# EAGLE schematic TeenScience-RevB3 (EAGLE 9.5.0), part 1 of 2

## Sheet 1 of 5
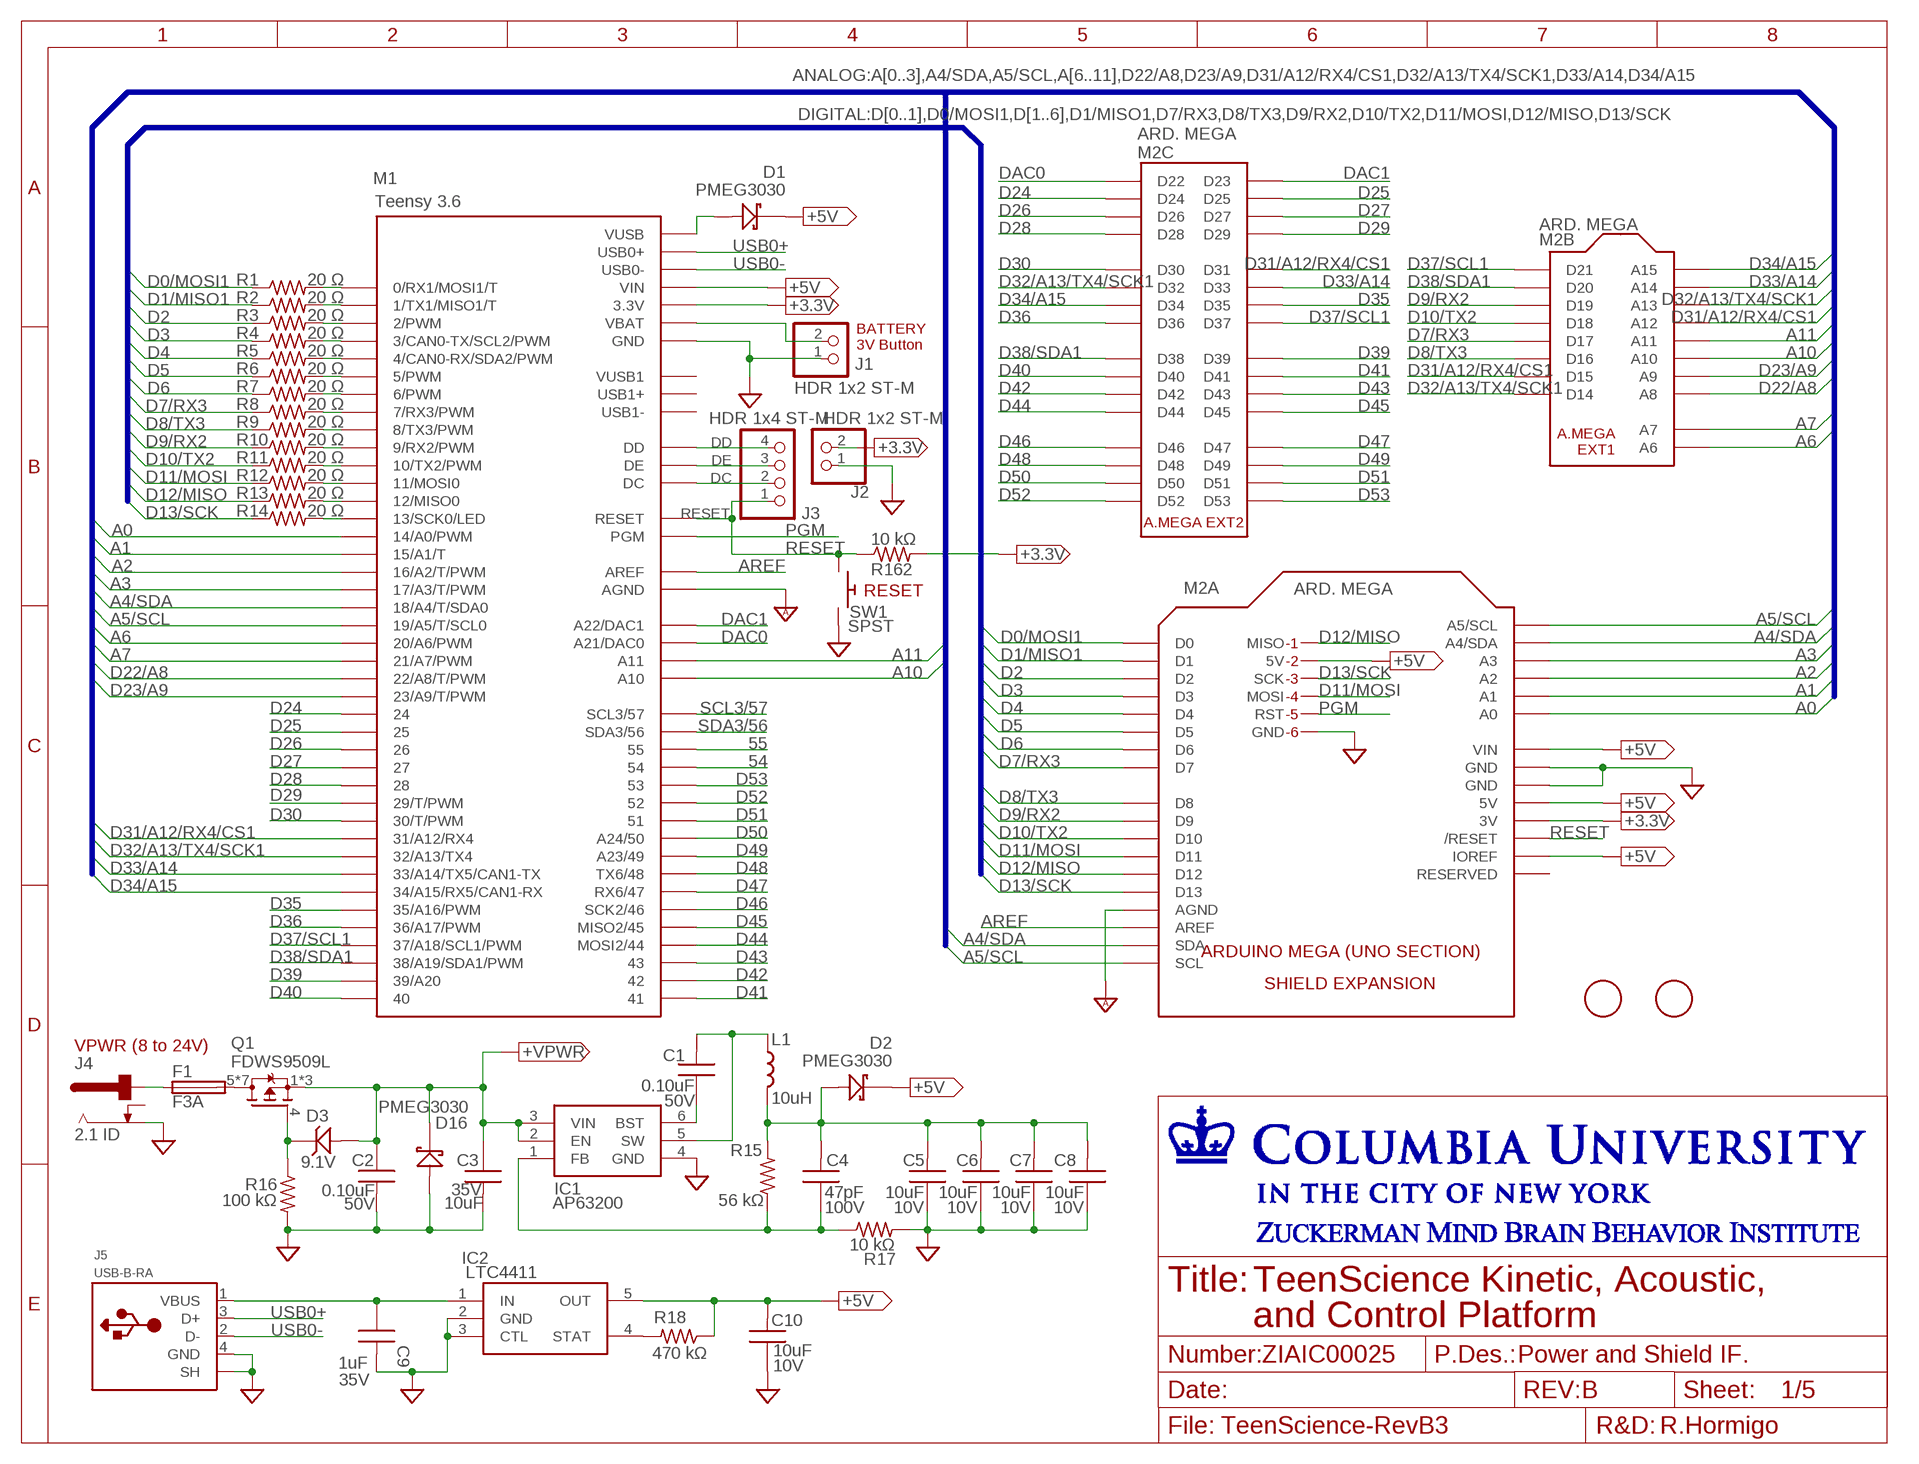
[diagram p0: schematic, sheet 1]
FRAME1 (LETTER_L): ENG_NAME: R.Hormigo; NUMBER: ZIAIC00025; PDESC: Power and Shield IF.; REV: B; TITLE_L1: TeenScience Kinetic, Acoustic,; TITLE_L2: and Control Platform

### Parts
C1  0.10uF  MLCC_0603_100N  [MLCC_0603]
C2  0.10uF  MLCC_0603_100N  [MLCC_0603]
C3  10uF  MLCC1206_  [MLCC_1206]
C4  47pF  MLCC_0603_47P  [MLCC_0603]
C5  10uF  MLCC_0603_10UF-10V  [MLCC_0603]
C6  10uF  MLCC_0603_10UF-10V  [MLCC_0603]
C7  10uF  MLCC_0603_10UF-10V  [MLCC_0603]
C8  10uF  MLCC_0603_10UF-10V  [MLCC_0603]
C9  1uF  MLCC_0603_1UF  [MLCC_0603]
C10  10uF  MLCC_0603_10UF-10V  [MLCC_0603]
D1  PMEG3030  DIODE_SCHOTTKY  [SOD_128_DIODE]
D2  PMEG3030  DIODE_SCHOTTKY  [SOD_128_DIODE]
D3  9.1V  DIODE_ZENERZND9.2V  [SOD3716X135N_DIODE]
D16  PMEG3030  DIODE_SCHOTTKY  [SOD_128_DIODE]
F1  F3A  FUSE  [1206-3.2X1.6MM]
IC1  AP63200  [SOT95P280X100-6N]
IC2  LTC4411  LTC4411ES5  [SOT95P280X100-5N]
J1  HDR 1x2 ST-M  PIN-1X22STMSHDR  [HDR_1X2]
J2  HDR 1x2 ST-M  PIN-1X22STMSHDR  [HDR_1X2]
J3  HDR 1x4 ST-M  PIN-1X44STMSHDR  [HDR_1X04]
J4  2.1 ID  DCJACK  [DCJACK-721RA]
J5  USB-B-RA  USB4+SHUSBBRA  [USB-B]
L1  10uH  INDUCTOR  [IND_5X5MM-5045]
M1  Teensy 3.6  TEENSY_3.X3_6ALL  [TEENSY_3.6_ALL_PINS&PADS]
M2  ARD. MEGA  ARDUINO_MEGA_ICSP  [ARDUINO_MEGA_ICSP]
Q1  FDWS9509L  MOSFET-PMFETPP-MOSFET  [FDN8_5.1X6.3]
R1  20 Ω  RES_0603_20R0  [R0603]
R2  20 Ω  RES_0603_20R0  [R0603]
R3  20 Ω  RES_0603_20R0  [R0603]
R4  20 Ω  RES_0603_20R0  [R0603]
R5  20 Ω  RES_0603_20R0  [R0603]
R6  20 Ω  RES_0603_20R0  [R0603]
R7  20 Ω  RES_0603_20R0  [R0603]
R8  20 Ω  RES_0603_20R0  [R0603]
R9  20 Ω  RES_0603_20R0  [R0603]
R10  20 Ω  RES_0603_20R0  [R0603]
R11  20 Ω  RES_0603_20R0  [R0603]
R12  20 Ω  RES_0603_20R0  [R0603]
R13  20 Ω  RES_0603_20R0  [R0603]
R14  20 Ω  RES_0603_20R0  [R0603]
R15  56 kΩ  RES_0603_56K0  [R0603]
R16  100 kΩ  RES_0603_100K  [R0603]
R17  10 kΩ  RES_0603_10K0  [R0603]
R18  470 kΩ  RES_0603_470K  [R0603]
R162  10 kΩ  RES_0603_10K0  [R0603]
SW1  SPST  SWITCH_SPSTSWDTS65  [SWITCH_TAC_6MM]
U$3  FIDUCIAL  [FIDUCIAL_1MM]
U$6  FIDUCIAL  [FIDUCIAL_1MM]

### Nets
54: M1.54 ; also sheet 4
55: M1.55 ; also sheet 4
+3.3V: J2.2 M1.3.3V M1.3.3V2(3.3V) M1.3.3V3(3.3V) M1.3.3V4(3.3V) M2.3V(A:3V) R162.2 ; also sheet 2,3,4,5
+5V: C10.2 D1.1(K) D2.1(K) IC2.5(OUT) M1.VIN M2.5V(A:5V) M2.5V@1(A:5V) M2.5V@2(A:5V) M2.5V_ICSP(A:5V) M2.IOREF(A:IOREF) M2.VIN(A:VIN) R18.1 ; also sheet 2,4,5
+VPWR: C2.1 C3.1 D3.2(A) D16.1(K) IC1.2(EN) IC1.3(VIN) Q1.1(S) Q1.2(S) Q1.3(S) ; also sheet 2,3,4
A0: M1.14/A0(14/A0/PWM) M2.A0(A:A0) ; also sheet 3
A1: M1.15/A1(15/A1/T) M2.A1(A:A1) ; also sheet 3
A2: M1.16/A2(16/A2/T/PWM) M2.A2(A:A2) ; also sheet 3
A3: M1.17/A3(17/A3/T/PWM) M2.A3(A:A3) ; also sheet 3
A4/SDA: M1.18/A4(18/A4/T/SDA0) M2.A4(A:A4/SDA) M2.SDA(A:SDA) ; also sheet 4,5
A5/SCL: M1.19/A5(19/A5/T/SCL0) M2.A5(A:A5/SCL) M2.SCL(A:SCL) ; also sheet 4,5
A6: M1.20/A6(20/A6/PWM) M2.A6(B:A6) ; also sheet 3
A7: M1.21/A7(21/A7/PWM) M2.A7(B:A7) ; also sheet 3
A10: M1.A10 M2.A10(B:A10)
A11: M1.A11 M2.A11(B:A11)
AREF: M1.AREF M2.AREF(A:AREF) ; also sheet 3
D0/MOSI1: M2.D0(A:D0) R1.1 ; also sheet 4
D1/MISO1: M2.D1(A:D1) R2.1 ; also sheet 4
D2: M2.D2(A:D2) R3.1 ; also sheet 2
D3: M2.D3(A:D3) R4.1 ; also sheet 2
D4: M2.D4(A:D4) R5.1 ; also sheet 2
D5: M2.D5(A:D5) R6.1 ; also sheet 2
D6: M2.D6(A:D6) R7.1 ; also sheet 2
D7/RX3: M2.D7(A:D7) M2.D17(B:D17) R8.1 ; also sheet 2
D8/TX3: M2.D8(A:D8) M2.D16(B:D16) R9.1 ; also sheet 2
D9/RX2: M2.D9(A:D9) M2.D19(B:D19) R10.1 ; also sheet 5
D10/TX2: M2.D10(A:D10) M2.D18(B:D18) R11.1 ; also sheet 4
D11/MOSI: M2.D11(A:D11) M2.MOSI(A:MOSI) R12.1 ; also sheet 5
D12/MISO: M2.D12(A:D12) M2.MISO(A:MISO) R13.1 ; also sheet 4
D13/SCK: M2.D13(A:D13) M2.SCK(A:SCK) R14.1 ; also sheet 5
D22/A8: M1.22/A8(22/A8/T/PWM) M2.A8(B:A8) ; also sheet 5
D23/A9: M1.23/A9(23/A9/T/PWM) M2.A9(B:A9) ; also sheet 5
D24: M1.24 M2.D24(C:D24) ; also sheet 2
D25: M1.25 M2.D25(C:D25) ; also sheet 2
D26: M1.26 M2.D26(C:D26) ; also sheet 2
D27: M1.27 M2.D27(C:D27) ; also sheet 2
D28: M1.28 M2.D28(C:D28) ; also sheet 2
D29: M1.29(29/T/PWM) M2.D29(C:D29) ; also sheet 2
D30: M1.30(30/T/PWM) M2.D30(C:D30) ; also sheet 2
D31/A12/RX4/CS1: M1.31/A12(31/A12/RX4) M2.A12(B:A12) M2.D15(B:D15) M2.D31(C:D31) ; also sheet 4
D32/A13/TX4/SCK1: M1.32/A13(32/A13/TX4) M2.A13(B:A13) M2.D14(B:D14) M2.D32(C:D32) ; also sheet 4
D33/A14: M1.33/A14(33/A14/TX5/CAN1-TX) M2.A14(B:A14) M2.D33(C:D33) ; also sheet 2
D34/A15: M1.34/A15(34/A15/RX5/CAN1-RX) M2.A15(B:A15) M2.D34(C:D34) ; also sheet 2
D35: M1.35/A16(35/A16/PWM) M2.D35(C:D35) ; also sheet 4
D36: M1.36/A17(36/A17/PWM) M2.D36(C:D36) ; also sheet 4
D37/SCL1: M1.37/A18(37/A18/SCL1/PWM) M2.D21(B:D21) M2.D37(C:D37) ; also sheet 4
D38/SDA1: M1.38/A19(38/A19/SDA1/PWM) M2.D20(B:D20) M2.D38(C:D38) ; also sheet 4
D39: M1.39/A20 M2.D39(C:D39) ; also sheet 4
D40: M1.40 M2.D40(C:D40) ; also sheet 4
D41: M1.41 M2.D41(C:D41) ; also sheet 4
D42: M1.42 M2.D42(C:D42) ; also sheet 4
D43: M1.43 M2.D43(C:D43) ; also sheet 2
D44: M1.44(MOSI2/44) M2.D44(C:D44) ; also sheet 2
D45: M1.45(MISO2/45) M2.D45(C:D45) ; also sheet 2
D46: M1.46(SCK2/46) M2.D46(C:D46) ; also sheet 2
D47: M1.47(RX6/47) M2.D47(C:D47) ; also sheet 4
D48: M1.48(TX6/48) M2.D48(C:D48) ; also sheet 2
D49: M1.49(A23/49) M2.D49(C:D49) ; also sheet 2
D50: M1.50(A24/50) M2.D50(C:D50) ; also sheet 2
D51: M1.51 M2.D51(C:D51) ; also sheet 2
D52: M1.52 M2.D52(C:D52) ; also sheet 2
D53: M1.53 M2.D53(C:D53) ; also sheet 2
DAC0: M1.A21(A21/DAC0) M2.D22(C:D22) ; also sheet 3
DAC1: M1.A22(A22/DAC1) M2.D23(C:D23) ; also sheet 3
DC: J3.2 M1.DC
DD: J3.4 M1.DD
DE: J3.3 M1.DE
GND: C2.2 C3.2 C5.1 C6.1 C7.1 C8.1 C9.2 C10.1 D16.2(A) IC1.4(GND) IC2.2(GND) IC2.3(CTL) J1.1 J2.1 J4.2(SLEEVE) J5.4(GND) J5.5(SH) J5.6(SH) M1.GND M1.GND1(GND) M1.GND2(GND) M1.GND3(GND) M1.GND4(GND) M1.GND5(GND) M1.GND6(GND) M2.GND@1(A:GND) M2.GND@2(A:GND) M2.GND@3(A:GND) M2.GND@4(A:GND) M2.GND@5(A:GND) R16.2 R17.2 SW1.3 SW1.4 ; also sheet 2,4,5
GND_A: M1.AGND M2.AGND(A:AGND) ; also sheet 3,5
N$1: D1.2(A) M1.VUSB
N$2: C9.1 IC2.1(IN) J5.1(VBUS)
N$3: IC2.4(STAT) R18.2
N$4: J1.2 M1.VBAT
N$5: F1.1 J4.1(CENTER)
N$6: C4.2 C5.2 C6.2 C7.2 C8.2 D2.2(A) L1.2 R15.2
N$7: F1.2 Q1.5(D) Q1.6(D) Q1.7(D) Q1.8(D) Q1.9(D) Q1.10(D) Q1.11(D)
N$8: D3.1(K) Q1.4(G) R16.1
N$10: C1.2 IC1.5(SW) L1.1
N$11: C4.1 IC1.1(FB) R15.1 R17.1
N$12: C1.1 IC1.6(BST)
N$13: M1.13(13/SCK0/LED) R14.2
N$18: M1.0(0/RX1/MOSI1/T) R1.2
N$21: M1.1(1/TX1/MISO1/T) R2.2
N$24: M1.2(2/PWM) R3.2
N$25: M1.3(3/CAN0-TX/SCL2/PWM) R4.2
N$26: M1.4(4/CAN0-RX/SDA2/PWM) R5.2
N$27: M1.5(5/PWM) R6.2
N$28: M1.6(6/PWM) R7.2
N$29: M1.7(7/RX3/PWM) R8.2
N$30: M1.8(8/TX3/PWM) R9.2
N$31: M1.9(9/RX2/PWM) R10.2
N$32: M1.10(10/TX2/PWM) R11.2
N$33: M1.11(11/MOSI0) R12.2
N$34: M1.12(12/MISO0) R13.2
PGM: M1.PGM M2.RESET_ICSP(A:RST)
RESET: J3.1 M1.RESET M2.RESET(A:/RESET) R162.1 SW1.1 SW1.2 ; also sheet 4,5
SCL3/57: M1.57(SCL3/57) ; also sheet 4
SDA3/56: M1.56(SDA3/56) ; also sheet 4
USB0+: J5.3(D+) M1.USB0+
USB0-: J5.2(D-) M1.USB0-
Unconnected: J4.3(SHUNT) M1.USB1+ M1.USB1- M2.RESERVED(A:RESERVED)

### Buses
DIGITAL:D[0..1],D0/MOSI1,D[1..6],D1/MISO1,D7/RX3,D8/TX3,D9/RX2,D10/TX2,D11/MOSI,D12/MISO,D13/SCK
ANALOG:A[0..3],A4/SDA,A5/SCL,A[6..11],D22/A8,D23/A9,D31/A12/RX4/CS1,D32/A13/TX4/SCK1,D33/A14,D34/A15

### Notes on the sheet
- BATTERY
  3V Button
- RESET
- VPWR (8 to 24V)

## Sheet 2 of 5
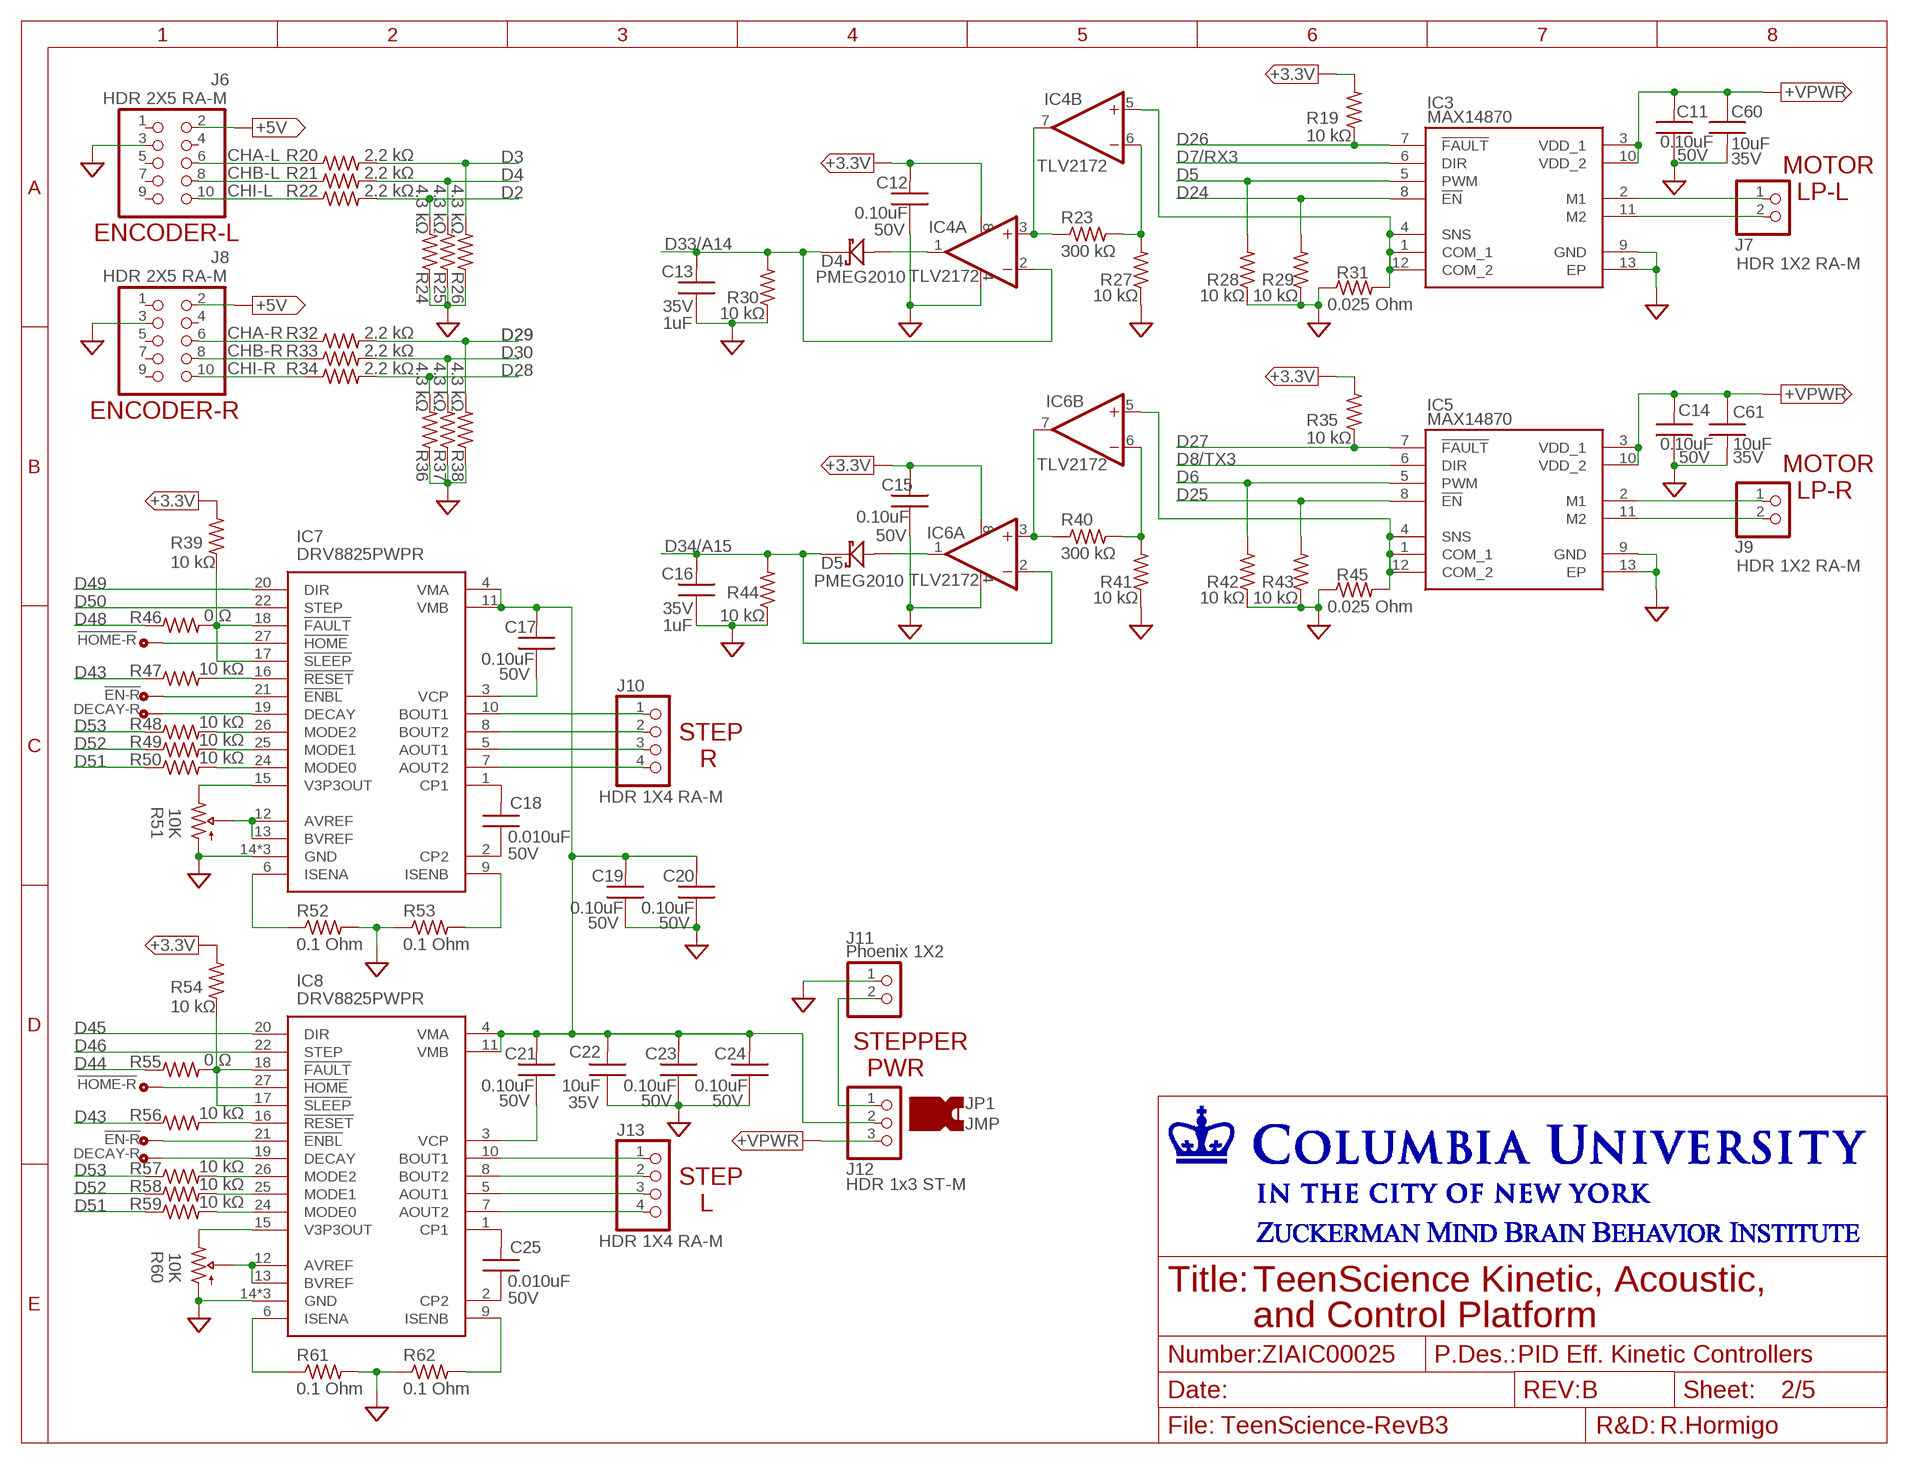
[diagram p1: schematic, sheet 2]
FRAME2 (LETTER_L): ENG_NAME: R.Hormigo; NUMBER: ZIAIC00025; PDESC: PID Eff. Kinetic Controllers; REV: B; TITLE_L1: TeenScience Kinetic, Acoustic,; TITLE_L2: and Control Platform
JP1 (JUMPERJUMPER): CURRENT: 1A; DESCRIPTION: Header Jumper 0.1"; DIMENSIONS: 0.1" Pitch 5X6mm; DSHEET: https://www.mouser.com/datasheet/2/181/M7580-M7583-1134644.pdf; MNF: Harwin; MPN: M7582-05; VALUE: JMP; VENDOR: Mouser

### Parts
C11  0.10uF  MLCC_0603_100N  [MLCC_0603]
C12  0.10uF  MLCC_0603_100N  [MLCC_0603]
C13  1uF  MLCC_0603_1UF  [MLCC_0603]
C14  0.10uF  MLCC_0603_100N  [MLCC_0603]
C15  0.10uF  MLCC_0603_100N  [MLCC_0603]
C16  1uF  MLCC_0603_1UF  [MLCC_0603]
C17  0.10uF  MLCC_0603_100N  [MLCC_0603]
C18  0.010uF  MLCC_0603_10N  [MLCC_0603]
C19  0.10uF  MLCC_0603_100N  [MLCC_0603]
C20  0.10uF  MLCC_0603_100N  [MLCC_0603]
C21  0.10uF  MLCC_0603_100N  [MLCC_0603]
C22  10uF  MLCC1206_  [MLCC_1206]
C23  0.10uF  MLCC_0603_100N  [MLCC_0603]
C24  0.10uF  MLCC_0603_100N  [MLCC_0603]
C25  0.010uF  MLCC_0603_10N  [MLCC_0603]
C60  10uF  MLCC1206_  [MLCC_1206]
C61  10uF  MLCC1206_  [MLCC_1206]
D4  PMEG2010  DIODE_SCHOTTKYSIGNAL_SCHOTTKY  [SOD-123FL]
D5  PMEG2010  DIODE_SCHOTTKYSIGNAL_SCHOTTKY  [SOD-123FL]
IC3  MAX14870  MAX14870ETC+TMAX14870FS  [TDFN12-EP]
IC4  TLV2172  OPA_D_TLV2172IDGKR  [VSSOP8-DGK-065P]
IC5  MAX14870  MAX14870ETC+TMAX14870FS  [TDFN12-EP]
IC6  TLV2172  OPA_D_TLV2172IDGKR  [VSSOP8-DGK-065P]
IC7  DRV8825PWPR  [TSSOP28-PWR]
IC8  DRV8825PWPR  [TSSOP28-PWR]
J6  HDR 2X5 RA-M  PIN-2X5HDR_2X5RAS_M  [HDR_2X5M_RAS]
J7  HDR 1X2 RA-M  PIN-1X2HDR_1X2RAS_M  [HDR_1X2RAS]
J8  HDR 2X5 RA-M  PIN-2X5HDR_2X5RAS_M  [HDR_2X5M_RAS]
J9  HDR 1X2 RA-M  PIN-1X2HDR_1X2RAS_M  [HDR_1X2RAS]
J10  HDR 1X4 RA-M  PIN-1X4HDR_1X4RAS_M  [HDR_1X4RAS]
J11  Phoenix 1X2  PIN-1X2PHO2PHOENIX1X2  [TE_282834-2_PHOENIX2]
J12  HDR 1x3 ST-M  PIN-1X33STMSHDR  [HDR_1X3]
J13  HDR 1X4 RA-M  PIN-1X4HDR_1X4RAS_M  [HDR_1X4RAS]
R19  10 kΩ  RES_0603_10K0  [R0603]
R20  2.2 kΩ  RES_0603_2K20  [R0603]
R21  2.2 kΩ  RES_0603_2K20  [R0603]
R22  2.2 kΩ  RES_0603_2K20  [R0603]
R23  300 kΩ  RES_0603_300K  [R0603]
R24  4.3 kΩ  RES_0603_4K30  [R0603]
R25  4.3 kΩ  RES_0603_4K30  [R0603]
R26  4.3 kΩ  RES_0603_4K30  [R0603]
R27  10 kΩ  RES_0603_10K0  [R0603]
R28  10 kΩ  RES_0603_10K0  [R0603]
R29  10 kΩ  RES_0603_10K0  [R0603]
R30  10 kΩ  RES_0603_10K0  [R0603]
R31  0.025 Ohm  RES_1206_0.025  [R1206]
R32  2.2 kΩ  RES_0603_2K20  [R0603]
R33  2.2 kΩ  RES_0603_2K20  [R0603]
R34  2.2 kΩ  RES_0603_2K20  [R0603]
R35  10 kΩ  RES_0603_10K0  [R0603]
R36  4.3 kΩ  RES_0603_4K30  [R0603]
R37  4.3 kΩ  RES_0603_4K30  [R0603]
R38  4.3 kΩ  RES_0603_4K30  [R0603]
R39  10 kΩ  RES_0603_10K0  [R0603]
R40  300 kΩ  RES_0603_300K  [R0603]
R41  10 kΩ  RES_0603_10K0  [R0603]
R42  10 kΩ  RES_0603_10K0  [R0603]
R43  10 kΩ  RES_0603_10K0  [R0603]
R44  10 kΩ  RES_0603_10K0  [R0603]
R45  0.025 Ohm  RES_1206_0.025  [R1206]
R46  0 Ω  RES_0603_0000  [R0603]
R47  10 kΩ  RES_0603_10K0  [R0603]
R48  10 kΩ  RES_0603_10K0  [R0603]
R49  10 kΩ  RES_0603_10K0  [R0603]
R50  10 kΩ  RES_0603_10K0  [R0603]
R51  10K  RES_TRIM_SMT_TRIM_4.5MM_10K  [SM-4.5X4.5-TRIM]
R52  0.1 Ohm  RES_1210_  [R1210]
R53  0.1 Ohm  RES_1210_  [R1210]
R54  10 kΩ  RES_0603_10K0  [R0603]
R55  0 Ω  RES_0603_0000  [R0603]
R56  10 kΩ  RES_0603_10K0  [R0603]
R57  10 kΩ  RES_0603_10K0  [R0603]
R58  10 kΩ  RES_0603_10K0  [R0603]
R59  10 kΩ  RES_0603_10K0  [R0603]
R60  10K  RES_TRIM_SMT_TRIM_4.5MM_10K  [SM-4.5X4.5-TRIM]
R61  0.1 Ohm  RES_1210_  [R1210]
R62  0.1 Ohm  RES_1210_  [R1210]
TP1  !HOME-R  SMT_TP  [SMT_TEST]
TP2  !EN-R  SMT_TP  [SMT_TEST]
TP3  DECAY-R  SMT_TP  [SMT_TEST]
TP4  !HOME-R  SMT_TP  [SMT_TEST]
TP5  !EN-R  SMT_TP  [SMT_TEST]
TP6  DECAY-R  SMT_TP  [SMT_TEST]

### Nets
+3.3V: C12.2 C15.2 IC4.8(A:V+) IC6.8(A:V+) R19.2 R35.2 R39.2 R54.2 ; also sheet 1,3,4,5
+5V: J6.2 J8.2 ; also sheet 1,4,5
+VPWR: C11.2 C14.2 C60.1 C61.1 IC3.3(VDD_1) IC3.10(VDD_2) IC5.3(VDD_1) IC5.10(VDD_2) J12.3 ; also sheet 1,3,4
CHA-L: J6.6 R20.1
CHA-R: J8.6 R32.1
CHB-L: J6.8 R21.1
CHB-R: J8.8 R33.1
CHI-L: J6.10 R22.1
CHI-R: J8.10 R34.1
D2: R22.2 R24.2 ; also sheet 1
D3: R20.2 R26.2 ; also sheet 1
D4: R21.2 R25.2 ; also sheet 1
D5: IC3.5(PWM) R28.2 ; also sheet 1
D6: IC5.5(PWM) R42.2 ; also sheet 1
D7/RX3: IC3.6(DIR) ; also sheet 1
D8/TX3: IC5.6(DIR) ; also sheet 1
D24: IC3.8(!EN) R29.2 ; also sheet 1
D25: IC5.8(!EN) R43.2 ; also sheet 1
D26: IC3.7(!FAULT) R19.1 ; also sheet 1
D27: IC5.7(!FAULT) R35.1 ; also sheet 1
D28: R34.2 R36.2 ; also sheet 1
D29: R32.2 R38.2 ; also sheet 1
D30: R33.2 R37.2 ; also sheet 1
D33/A14: C13.2 D4.1(K) IC4.2(A:-IN) R30.2 ; also sheet 1
D34/A15: C16.2 D5.1(K) IC6.2(A:-IN) R44.2 ; also sheet 1
D43: R47.1 R56.1 ; also sheet 1
D44: R55.1 ; also sheet 1
D45: IC8.20(DIR) ; also sheet 1
D46: IC8.22(STEP) ; also sheet 1
D48: R46.1 ; also sheet 1
D49: IC7.20(DIR) ; also sheet 1
D50: IC7.22(STEP) ; also sheet 1
D51: R50.1 R59.1 ; also sheet 1
D52: R49.1 R58.1 ; also sheet 1
D53: R48.1 R57.1 ; also sheet 1
GND: C11.1 C12.1 C13.1 C14.1 C15.1 C16.1 C19.1 C20.1 C22.1 C23.1 C24.1 C60.2 C61.2 IC3.9(GND) IC3.13(EP) IC4.4(A:V-) IC5.9(GND) IC5.13(EP) IC6.4(A:V-) IC7.14(GND) IC7.28(GND) IC7.29(GND) IC8.14(GND) IC8.28(GND) IC8.29(GND) J6.3 J8.3 J11.1 R24.1 R25.1 R26.1 R27.1 R28.1 R29.1 R30.1 R31.1 R36.1 R37.1 R38.1 R41.1 R42.1 R43.1 R44.1 R45.1 R51.3(START) R52.2 R53.1 R60.3(START) R61.2 R62.1 ; also sheet 1,4,5
N$35: IC5.2(M1) J9.1
N$36: IC5.11(M2) J9.2
N$37: D5.2(A) IC6.1(A:OUT)
N$38: IC6.6(B:-IN) R40.2 R41.2
N$39: IC5.1(COM_1) IC5.4(SNS) IC5.12(COM_2) IC6.5(B:+IN) R45.2
N$40: IC3.2(M1) J7.1
N$41: IC6.3(A:+IN) IC6.7(B:OUT) R40.1
N$42: IC3.11(M2) J7.2
N$43: IC3.1(COM_1) IC3.4(SNS) IC3.12(COM_2) IC4.5(B:+IN) R31.2
N$44: D4.2(A) IC4.1(A:OUT)
N$45: IC4.6(B:-IN) R23.2 R27.2
N$46: IC4.3(A:+IN) IC4.7(B:OUT) R23.1
N$49: J11.2 J12.1
N$50: IC8.15(V3P3OUT) R60.1(END)
N$51: IC8.12(AVREF) IC8.13(BVREF) R60.2(WIPER)
N$52: IC8.6(ISENA) R61.1
N$53: C21.1 IC8.3(VCP)
N$54: IC8.9(ISENB) R62.2
N$55: C25.1 IC8.2(CP2)
N$56: C25.2 IC8.1(CP1)
N$57: IC8.10(BOUT1) J13.1
N$58: IC8.8(BOUT2) J13.2
N$59: IC8.5(AOUT1) J13.3
N$60: IC8.7(AOUT2) J13.4
N$61: IC8.27(!HOME) TP1.NC1 TP1.NC2 TP1.NC3 TP1.TP
N$62: IC8.24(MODE0) R59.2
N$63: IC8.25(MODE1) R58.2
N$64: IC8.26(MODE2) R57.2
N$65: C17.2 C19.2 C20.2 C21.2 C22.2 C23.2 C24.2 IC7.4(VMA) IC7.11(VMB) IC8.4(VMA) IC8.11(VMB) J12.2
N$66: IC7.12(AVREF) IC7.13(BVREF) R51.2(WIPER)
N$67: IC7.6(ISENA) R52.1
N$68: IC8.17(!SLEEP) IC8.18(!FAULT) R54.1 R55.2
N$69: IC7.9(ISENB) R53.2
N$70: C18.1 IC7.2(CP2)
N$71: C18.2 IC7.1(CP1)
N$72: IC7.15(V3P3OUT) R51.1(END)
N$73: IC8.19(DECAY) TP3.NC1 TP3.NC2 TP3.NC3 TP3.TP
N$74: IC8.21(!ENBL) TP2.NC1 TP2.NC2 TP2.NC3 TP2.TP
N$75: IC8.16(!RESET) R56.2
N$76: C17.1 IC7.3(VCP)
N$77: IC7.10(BOUT1) J10.1
N$78: IC7.8(BOUT2) J10.2
N$79: IC7.5(AOUT1) J10.3
N$80: IC7.7(AOUT2) J10.4
N$81: IC7.27(!HOME) TP4.NC1 TP4.NC2 TP4.NC3 TP4.TP
N$82: IC7.24(MODE0) R50.2
N$83: IC7.25(MODE1) R49.2
N$84: IC7.26(MODE2) R48.2
N$85: IC7.17(!SLEEP) IC7.18(!FAULT) R39.1 R46.2
N$86: IC7.19(DECAY) TP6.NC1 TP6.NC2 TP6.NC3 TP6.TP
N$87: IC7.21(!ENBL) TP5.NC1 TP5.NC2 TP5.NC3 TP5.TP
N$88: IC7.16(!RESET) R47.2
Unconnected: J6.1 J6.4 J6.5 J6.7 J6.9 J8.1 J8.4 J8.5 J8.7 J8.9

### Notes on the sheet
- MOTOR
    LP-L
- ENCODER-L
- ENCODER-R
- MOTOR
    LP-R
- STEP
     R
- STEPPER
    PWR
- STEP
     L

## Sheet 3 of 5
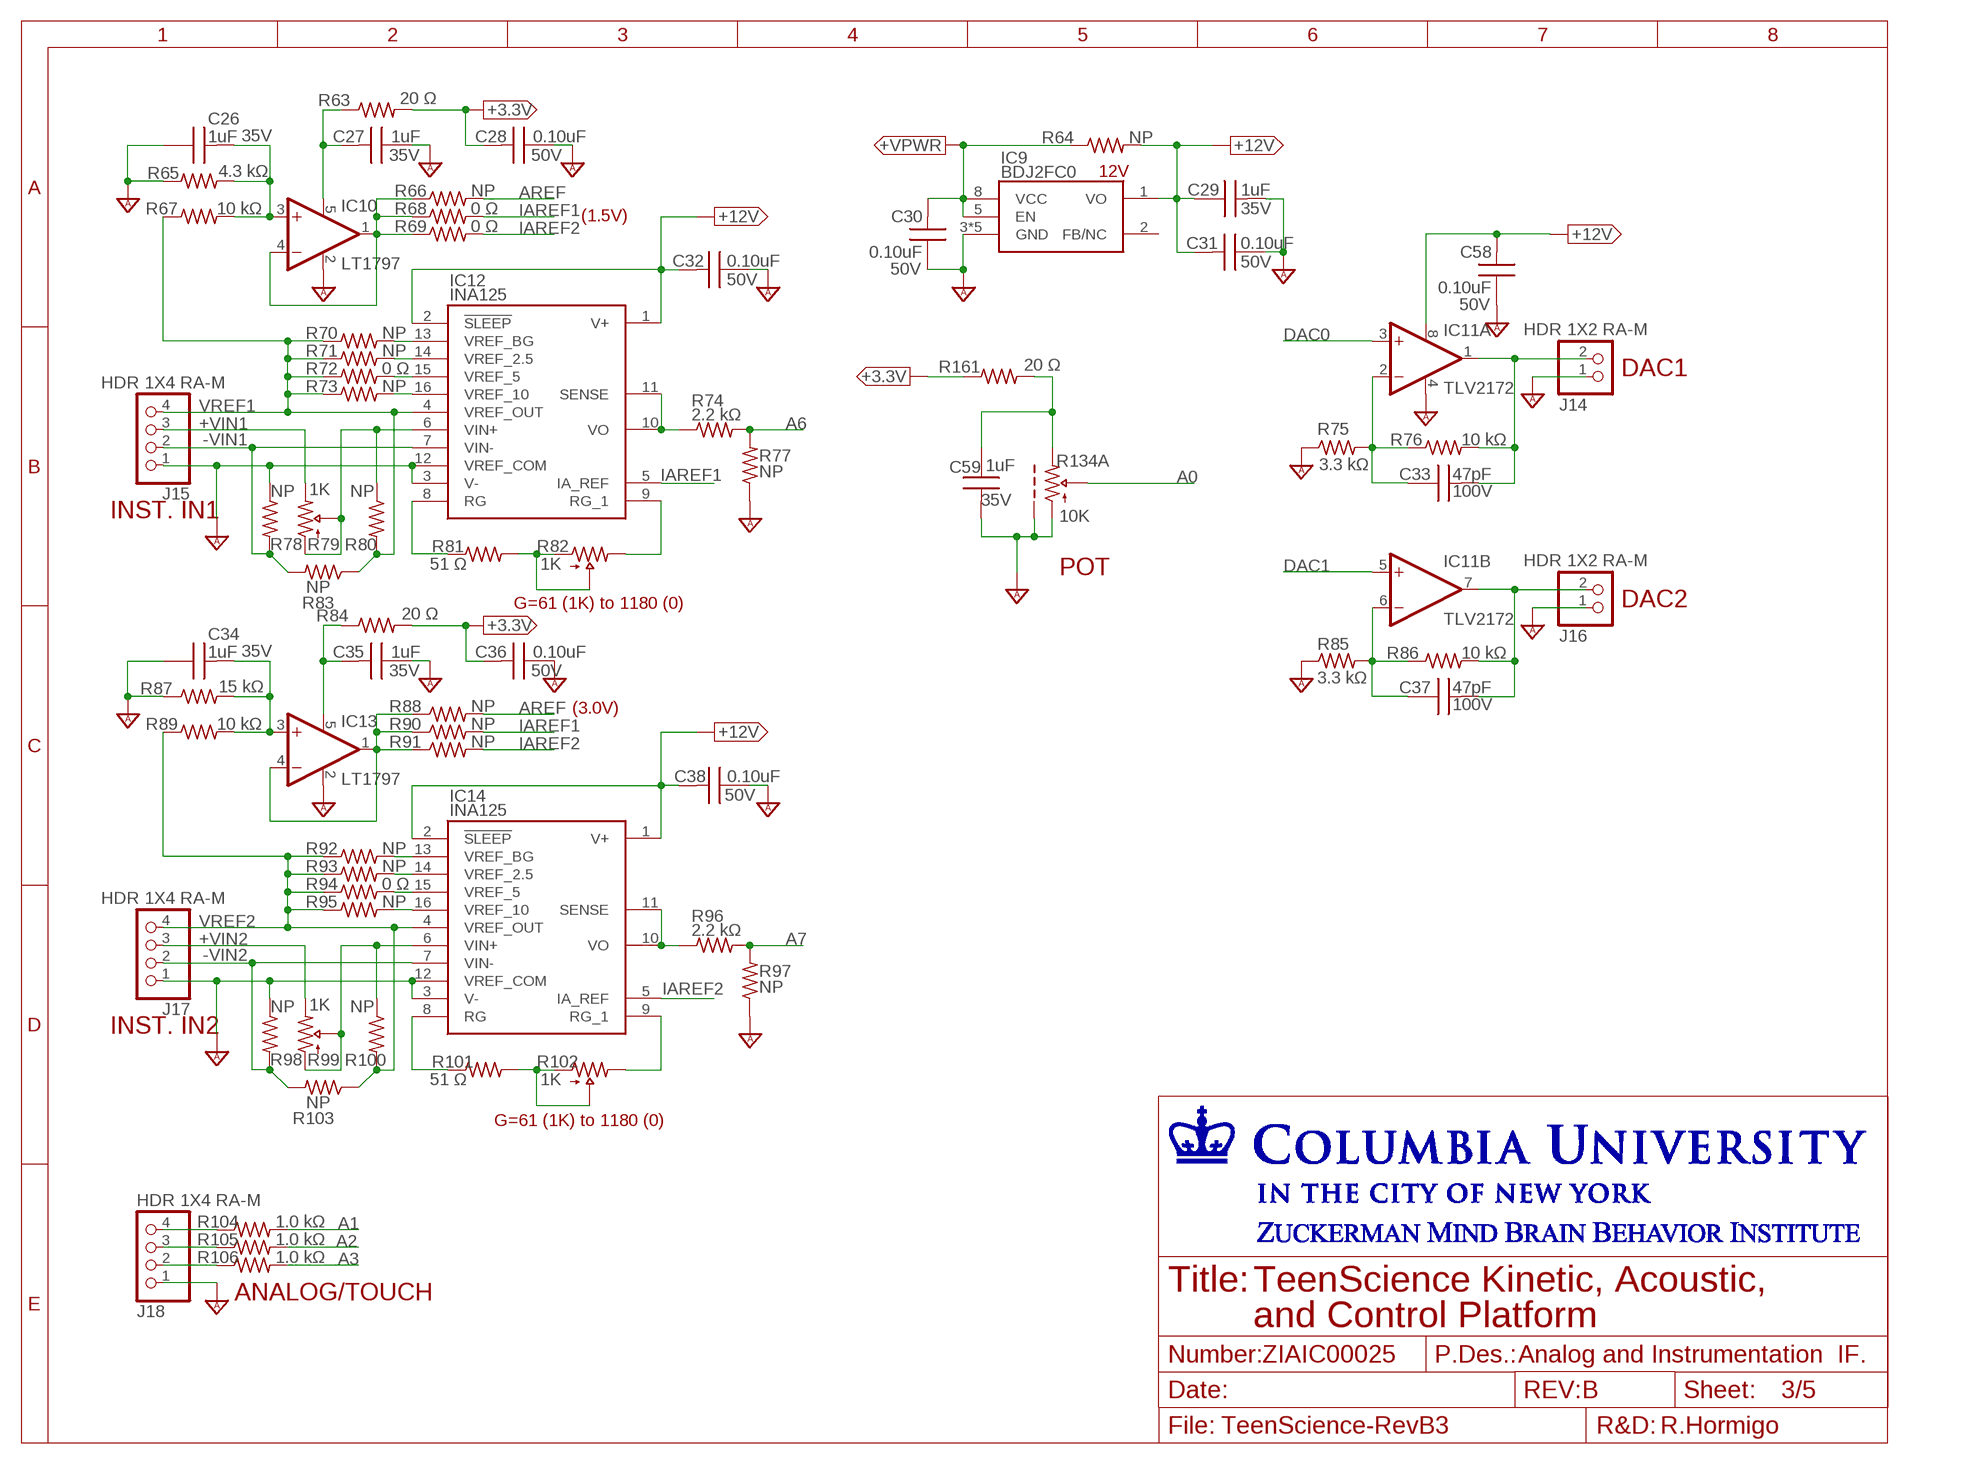
[diagram p2: schematic, sheet 3]
FRAME3 (LETTER_L): ENG_NAME: R.Hormigo; NUMBER: ZIAIC00025; PDESC: Analog and Instrumentation IF.; REV: B; TITLE_L1: TeenScience Kinetic, Acoustic,; TITLE_L2: and Control Platform

### Parts
C26  1uF  MLCC_0603_1UF  [MLCC_0603]
C27  1uF  MLCC_0603_1UF  [MLCC_0603]
C28  0.10uF  MLCC_0603_100N  [MLCC_0603]
C29  1uF  MLCC_0603_1UF  [MLCC_0603]
C30  0.10uF  MLCC_0603_100N  [MLCC_0603]
C31  0.10uF  MLCC_0603_100N  [MLCC_0603]
C32  0.10uF  MLCC_0603_100N  [MLCC_0603]
C33  47pF  MLCC_0603_47P  [MLCC_0603]
C34  1uF  MLCC_0603_1UF  [MLCC_0603]
C35  1uF  MLCC_0603_1UF  [MLCC_0603]
C36  0.10uF  MLCC_0603_100N  [MLCC_0603]
C37  47pF  MLCC_0603_47P  [MLCC_0603]
C38  0.10uF  MLCC_0603_100N  [MLCC_0603]
C58  0.10uF  MLCC_0603_100N  [MLCC_0603]
C59  1uF  MLCC_0603_1UF  [MLCC_0603]
IC9  BDJ2FC0  BDXXFC0  [SOIC8-PAD127P600X100]
IC10  LT1797  OPA_S_LT1797  [SOT23-5]
IC11  TLV2172  OPA_D_TLV2172IDGKR  [VSSOP8-DGK-065P]
IC12  INA125  INA125U  [SOIC16-127P600X175]
IC13  LT1797  OPA_S_LT1797  [SOT23-5]
IC14  INA125  INA125U  [SOIC16-127P600X175]
J14  HDR 1X2 RA-M  PIN-1X2HDR_1X2RAS_M  [HDR_1X2RAS]
J15  HDR 1X4 RA-M  PIN-1X4HDR_1X4RAS_M  [HDR_1X4RAS]
J16  HDR 1X2 RA-M  PIN-1X2HDR_1X2RAS_M  [HDR_1X2RAS]
J17  HDR 1X4 RA-M  PIN-1X4HDR_1X4RAS_M  [HDR_1X4RAS]
J18  HDR 1X4 RA-M  PIN-1X4HDR_1X4RAS_M  [HDR_1X4RAS]
R63  20 Ω  RES_0603_20R0  [R0603]
R64  NP  RES_0603_NP  [R0603]
R65  4.3 kΩ  RES_0603_4K30  [R0603]
R66  NP  RES_0603_NP  [R0603]
R67  10 kΩ  RES_0603_10K0  [R0603]
R68  0 Ω  RES_0603_0000  [R0603]
R69  0 Ω  RES_0603_0000  [R0603]
R70  NP  RES_0603_NP  [R0603]
R71  NP  RES_0603_NP  [R0603]
R72  0 Ω  RES_0603_0000  [R0603]
R73  NP  RES_0603_NP  [R0603]
R74  2.2 kΩ  RES_0603_2K20  [R0603]
R75  3.3 kΩ  RES_0603_3K30  [R0603]
R76  10 kΩ  RES_0603_10K0  [R0603]
R77  NP  RES_0603_NP  [R0603]
R78  NP  RES_0603_NP  [R0603]
R79  1K  RES_TRIM_1K  [PV36YTRIMMER]
R80  NP  RES_0603_NP  [R0603]
R81  51 Ω  RES_0603_51R0  [R0603]
R82  1K  RES_TRIM_1K  [PV36YTRIMMER]
R83  NP  RES_0603_NP  [R0603]
R84  20 Ω  RES_0603_20R0  [R0603]
R85  3.3 kΩ  RES_0603_3K30  [R0603]
R86  10 kΩ  RES_0603_10K0  [R0603]
R87  15 kΩ  RES_0603_15K0  [R0603]
R88  NP  RES_0603_NP  [R0603]
R89  10 kΩ  RES_0603_10K0  [R0603]
R90  NP  RES_0603_NP  [R0603]
R91  NP  RES_0603_NP  [R0603]
R92  NP  RES_0603_NP  [R0603]
R93  NP  RES_0603_NP  [R0603]
R94  0 Ω  RES_0603_0000  [R0603]
R95  NP  RES_0603_NP  [R0603]
R96  2.2 kΩ  RES_0603_2K20  [R0603]
R97  NP  RES_0603_NP  [R0603]
R98  NP  RES_0603_NP  [R0603]
R99  1K  RES_TRIM_1K  [PV36YTRIMMER]
R100  NP  RES_0603_NP  [R0603]
R101  51 Ω  RES_0603_51R0  [R0603]
R102  1K  RES_TRIM_1K  [PV36YTRIMMER]
R103  NP  RES_0603_NP  [R0603]
R104  1.0 kΩ  RES_0603_1K00  [R0603]
R105  1.0 kΩ  RES_0603_1K00  [R0603]
R106  1.0 kΩ  RES_0603_1K00  [R0603]
R134  10K  POT  [RK09-ALPS-VERT-POT]
R161  20 Ω  RES_0603_20R0  [R0603]

### Nets
+3.3V: C28.2 C36.2 R63.2 R84.2 R161.1 ; also sheet 1,2,4,5
+12V: C29.1 C31.2 C32.2 C38.2 C58.2 IC9.1(VO) IC11.8(A:V+) IC12.1(V+) IC12.2(!SLEEP) IC14.1(V+) IC14.2(!SLEEP) R64.2
+VIINDIR1: IC12.6(VIN+) R79.1(START) R79.2(WIPER) R80.1
+VIINDIR2: IC14.6(VIN+) R99.1(START) R99.2(WIPER) R100.1
+VIN1: J15.3 R79.3(END)
+VIN2: J17.3 R99.3(END)
+VPWR: C30.2 IC9.5(EN) IC9.8(VCC) R64.1 ; also sheet 1,2,4
-VIN1: IC12.7(VIN-) J15.2 R78.2 R83.2
-VIN2: IC14.7(VIN-) J17.2 R98.2 R103.2
A0: R134.2(A:WIPER) ; also sheet 1
A1: R104.2 ; also sheet 1
A2: R105.2 ; also sheet 1
A3: R106.2 ; also sheet 1
A6: R74.2 R77.2 ; also sheet 1
A7: R96.2 R97.2 ; also sheet 1
AREF: R66.2 R88.2 ; also sheet 1
DAC0: IC11.3(A:+IN) ; also sheet 1
DAC1: IC11.5(B:+IN) ; also sheet 1
GND_A: C26.1 C27.1 C28.1 C29.2 C30.1 C31.1 C32.1 C34.1 C35.1 C36.1 C38.1 C58.1 C59.2 IC9.3(GND) IC9.4(GND) IC9.6(GND) IC9.7(GND) IC9.9(GND) IC10.2(V-) IC11.4(A:V-) IC12.3(V-) IC12.12(VREF_COM) IC13.2(V-) IC14.3(V-) IC14.12(VREF_COM) J14.1 J15.1 J16.1 J17.1 J18.1 R65.1 R75.1 R77.1 R78.1 R85.1 R87.1 R97.1 R98.1 R134.1(A:START) R134.MH1(B:SHELL) R134.MH2(B:SHELL) ; also sheet 1,5
IAREF1: IC12.5(IA_REF) R68.2 R90.2
IAREF2: IC14.5(IA_REF) R69.2 R91.2
N$20: C27.2 IC10.5(V+) R63.1
N$23: C59.1 R134.3(A:END) R161.2
N$48: J18.4 R104.1
N$89: J18.3 R105.1
N$90: J18.2 R106.1
N$103: IC12.10(VO) IC12.11(SENSE) R74.1
N$104: IC12.13(VREF_BG) R70.2
N$105: C26.2 IC10.3(+IN) R65.2 R67.2
N$106: IC10.1(OUT) IC10.4(-IN) R66.1 R68.1 R69.1
N$107: R81.2 R82.1(START) R82.2(WIPER)
N$108: IC12.14(VREF_2.5) R71.2
N$109: IC12.15(VREF_5) R72.2
N$110: IC12.16(VREF_10) R73.2
N$111: R101.2 R102.1(START) R102.2(WIPER)
N$112: IC12.8(RG) R81.1
N$113: IC12.9(RG_1) R82.3(END)
N$114: IC14.14(VREF_2.5) R93.2
N$115: IC14.15(VREF_5) R94.2
N$116: IC14.16(VREF_10) R95.2
N$117: IC14.8(RG) R101.1
N$118: IC14.9(RG_1) R102.3(END)
N$119: IC14.13(VREF_BG) R92.2
N$120: IC14.10(VO) IC14.11(SENSE) R96.1
N$121: C34.2 IC13.3(+IN) R87.2 R89.2
N$122: IC13.1(OUT) IC13.4(-IN) R88.1 R90.1 R91.1
N$123: C35.2 IC13.5(V+) R84.1
N$124: C33.1 IC11.2(A:-IN) R75.2 R76.1
N$125: C33.2 IC11.1(A:OUT) J14.2 R76.2
N$127: C37.1 IC11.6(B:-IN) R85.2 R86.1
N$128: C37.2 IC11.7(B:OUT) J16.2 R86.2
VREF1: IC12.4(VREF_OUT) J15.4 R67.1 R70.1 R71.1 R72.1 R73.1 R80.2 R83.1
VREF2: IC14.4(VREF_OUT) J17.4 R89.1 R92.1 R93.1 R94.1 R95.1 R100.2 R103.1
Unconnected: IC9.2(FB/NC)

### Notes on the sheet
- 12V
- (1.5V)
- DAC1
- INST. IN1
- POT
- G=61 (1K) to 1180 (0) | DAC2
- (3.0V)
- INST. IN2
- G=61 (1K) to 1180 (0)
- ANALOG/TOUCH

## Sheet 4 of 5
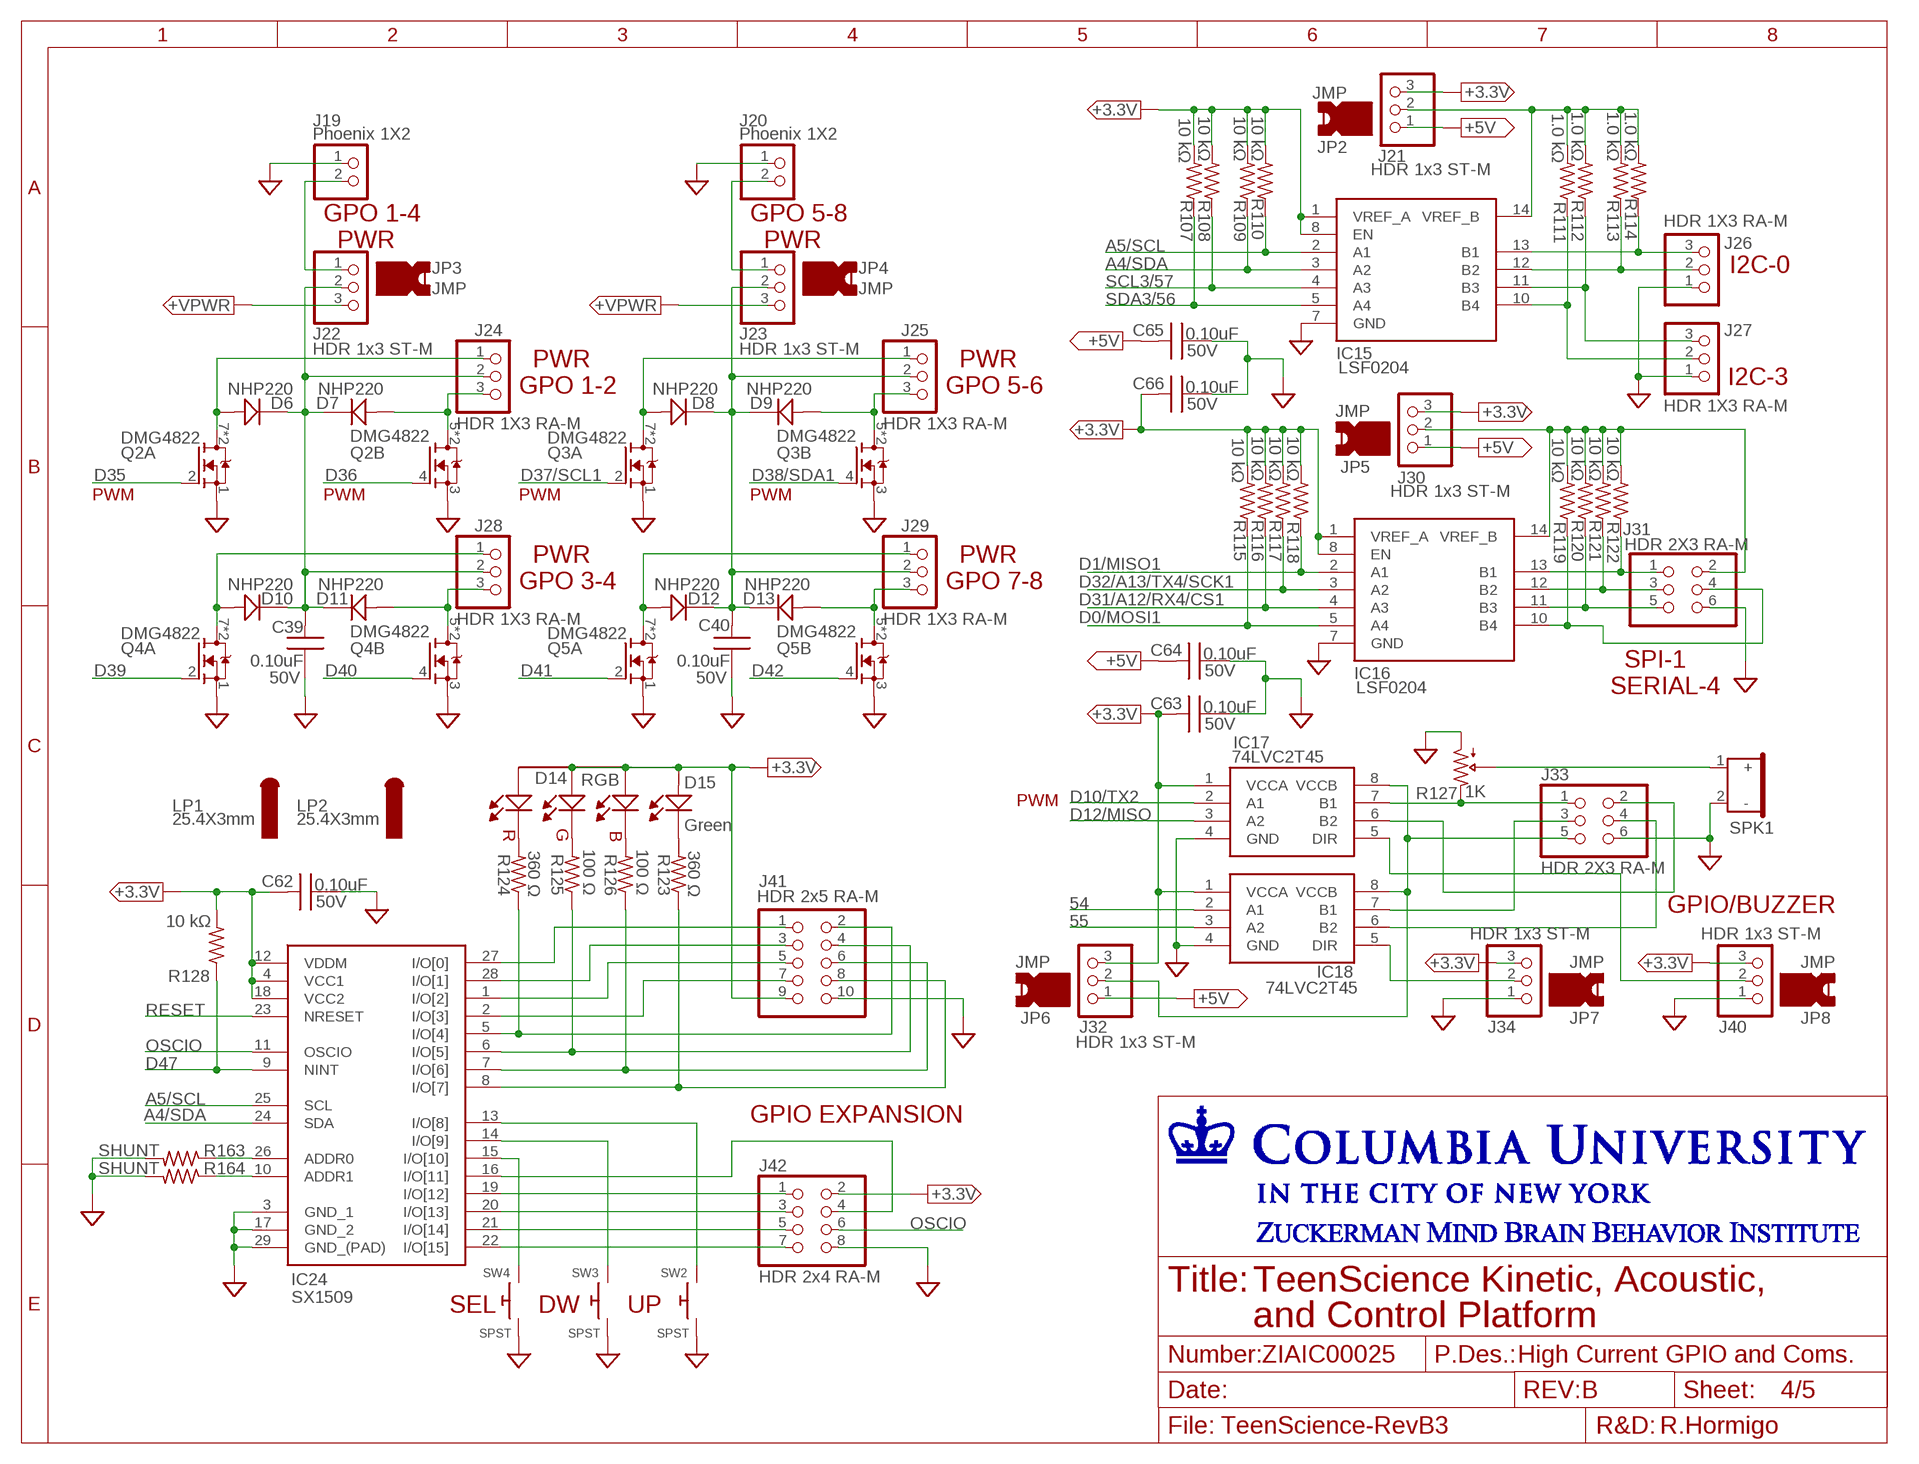
[diagram p3: schematic, sheet 4]
FRAME4 (LETTER_L): ENG_NAME: R.Hormigo; NUMBER: ZIAIC00025; PDESC: High Current GPIO and Coms.; REV: B; TITLE_L1: TeenScience Kinetic, Acoustic,; TITLE_L2: and Control Platform
JP2 (JUMPERJUMPER): CURRENT: 1A; DESCRIPTION: Header Jumper 0.1"; DIMENSIONS: 0.1" Pitch 5X6mm; DSHEET: https://www.mouser.com/datasheet/2/181/M7580-M7583-1134644.pdf; MNF: Harwin; MPN: M7582-05; VALUE: JMP; VENDOR: Mouser
JP3 (JUMPERJUMPER): CURRENT: 1A; DESCRIPTION: Header Jumper 0.1"; DIMENSIONS: 0.1" Pitch 5X6mm; DSHEET: https://www.mouser.com/datasheet/2/181/M7580-M7583-1134644.pdf; MNF: Harwin; MPN: M7582-05; VALUE: JMP; VENDOR: Mouser
JP4 (JUMPERJUMPER): CURRENT: 1A; DESCRIPTION: Header Jumper 0.1"; DIMENSIONS: 0.1" Pitch 5X6mm; DSHEET: https://www.mouser.com/datasheet/2/181/M7580-M7583-1134644.pdf; MNF: Harwin; MPN: M7582-05; VALUE: JMP; VENDOR: Mouser
JP5 (JUMPERJUMPER): CURRENT: 1A; DESCRIPTION: Header Jumper 0.1"; DIMENSIONS: 0.1" Pitch 5X6mm; DSHEET: https://www.mouser.com/datasheet/2/181/M7580-M7583-1134644.pdf; MNF: Harwin; MPN: M7582-05; VALUE: JMP; VENDOR: Mouser
JP6 (JUMPERJUMPER): CURRENT: 1A; DESCRIPTION: Header Jumper 0.1"; DIMENSIONS: 0.1" Pitch 5X6mm; DSHEET: https://www.mouser.com/datasheet/2/181/M7580-M7583-1134644.pdf; MNF: Harwin; MPN: M7582-05; VALUE: JMP; VENDOR: Mouser
JP7 (JUMPERJUMPER): CURRENT: 1A; DESCRIPTION: Header Jumper 0.1"; DIMENSIONS: 0.1" Pitch 5X6mm; DSHEET: https://www.mouser.com/datasheet/2/181/M7580-M7583-1134644.pdf; MNF: Harwin; MPN: M7582-05; VALUE: JMP; VENDOR: Mouser
JP8 (JUMPERJUMPER): CURRENT: 1A; DESCRIPTION: Header Jumper 0.1"; DIMENSIONS: 0.1" Pitch 5X6mm; DSHEET: https://www.mouser.com/datasheet/2/181/M7580-M7583-1134644.pdf; MNF: Harwin; MPN: M7582-05; VALUE: JMP; VENDOR: Mouser

### Parts
C39  0.10uF  MLCC_0603_100N  [MLCC_0603]
C40  0.10uF  MLCC_0603_100N  [MLCC_0603]
C62  0.10uF  MLCC_0603_100N  [MLCC_0603]
C63  0.10uF  MLCC_0603_100N  [MLCC_0603]
C64  0.10uF  MLCC_0603_100N  [MLCC_0603]
C65  0.10uF  MLCC_0603_100N  [MLCC_0603]
C66  0.10uF  MLCC_0603_100N  [MLCC_0603]
D6  NHP220  DIODE_RECNHP220  [SOD-123FL]
D7  NHP220  DIODE_RECNHP220  [SOD-123FL]
D8  NHP220  DIODE_RECNHP220  [SOD-123FL]
D9  NHP220  DIODE_RECNHP220  [SOD-123FL]
D10  NHP220  DIODE_RECNHP220  [SOD-123FL]
D11  NHP220  DIODE_RECNHP220  [SOD-123FL]
D12  NHP220  DIODE_RECNHP220  [SOD-123FL]
D13  NHP220  DIODE_RECNHP220  [SOD-123FL]
D14  RGB  DIODE_CA_RGBLEDLEDRGB  [SON95P2X2X1-RGB_LED]
D15  Green  DIODE_GENLED0603LEDG  [LED_0603]
IC15  LSF0204  [TSSOP14]
IC16  LSF0204  [TSSOP14]
IC17  74LVC2T45  74LVC2T45DCUR  [VSSOP8-DCU-050P]
IC18  74LVC2T45  74LVC2T45DCUR  [VSSOP8-DCU-050P]
IC24  SX1509  [QFN-28-4MM-0.4P-PAD]
J19  Phoenix 1X2  PIN-1X2PHO2PHOENIX1X2  [TE_282834-2_PHOENIX2]
J20  Phoenix 1X2  PIN-1X2PHO2PHOENIX1X2  [TE_282834-2_PHOENIX2]
J21  HDR 1x3 ST-M  PIN-1X33STMSHDR  [HDR_1X3]
J22  HDR 1x3 ST-M  PIN-1X33STMSHDR  [HDR_1X3]
J23  HDR 1x3 ST-M  PIN-1X33STMSHDR  [HDR_1X3]
J24  HDR 1X3 RA-M  PIN-1X3HDR_1X3RAS_M  [HDR_1X3RAS]
J25  HDR 1X3 RA-M  PIN-1X3HDR_1X3RAS_M  [HDR_1X3RAS]
J26  HDR 1X3 RA-M  PIN-1X3HDR_1X3RAS_M  [HDR_1X3RAS]
J27  HDR 1X3 RA-M  PIN-1X3HDR_1X3RAS_M  [HDR_1X3RAS]
J28  HDR 1X3 RA-M  PIN-1X3HDR_1X3RAS_M  [HDR_1X3RAS]
J29  HDR 1X3 RA-M  PIN-1X3HDR_1X3RAS_M  [HDR_1X3RAS]
J30  HDR 1x3 ST-M  PIN-1X33STMSHDR  [HDR_1X3]
J31  HDR 2X3 RA-M  PIN-2X3HDR_2X3RAS_MRAS_2X3  [HDR_2X3M_RAS]
J32  HDR 1x3 ST-M  PIN-1X33STMSHDR  [HDR_1X3]
J33  HDR 2X3 RA-M  PIN-2X3HDR_2X3RAS_MRAS_2X3  [HDR_2X3M_RAS]
J34  HDR 1x3 ST-M  PIN-1X33STMSHDR  [HDR_1X3]
J40  HDR 1x3 ST-M  PIN-1X33STMSHDR  [HDR_1X3]
J41  HDR 2x5 RA-M  PIN-2X5HDR_2X5M_RA  [HDR_2X5M-RAHDR]
J42  HDR 2x4 RA-M  PIN-2X4  [HDR_2X4M-RAHDR]
LP1  25.4X3mm  LIGHT_PIPE  [EXTERNAL]
LP2  25.4X3mm  LIGHT_PIPE  [EXTERNAL]
Q2  DMG4822  MOSFET-NX2  [SOIC8-127P60]
Q3  DMG4822  MOSFET-NX2  [SOIC8-127P60]
Q4  DMG4822  MOSFET-NX2  [SOIC8-127P60]
Q5  DMG4822  MOSFET-NX2  [SOIC8-127P60]
R107  10 kΩ  RES_0603_10K0  [R0603]
R108  10 kΩ  RES_0603_10K0  [R0603]
R109  10 kΩ  RES_0603_10K0  [R0603]
R110  10 kΩ  RES_0603_10K0  [R0603]
R111  1.0 kΩ  RES_0603_1K00  [R0603]
R112  1.0 kΩ  RES_0603_1K00  [R0603]
R113  1.0 kΩ  RES_0603_1K00  [R0603]
R114  1.0 kΩ  RES_0603_1K00  [R0603]
R115  10 kΩ  RES_0603_10K0  [R0603]
R116  10 kΩ  RES_0603_10K0  [R0603]
R117  10 kΩ  RES_0603_10K0  [R0603]
R118  10 kΩ  RES_0603_10K0  [R0603]
R119  10 kΩ  RES_0603_10K0  [R0603]
R120  10 kΩ  RES_0603_10K0  [R0603]
R121  10 kΩ  RES_0603_10K0  [R0603]
R122  10 kΩ  RES_0603_10K0  [R0603]
R123  360 Ω  RES_0603_360R  [R0603]
R124  360 Ω  RES_0603_360R  [R0603]
R125  100 Ω  RES_0603_100R  [R0603]
R126  100 Ω  RES_0603_100R  [R0603]
R127  1K  RES_TRIM_RES_1K_SMT_TRIM_4.5MM_10K  [SM-4.5X4.5-TRIM]
R128  10 kΩ  RES_0603_10K0  [R0603]
R163  SHUNT  RES_0603_SHUNT  [R0603-SHORT]
R164  SHUNT  RES_0603_SHUNT  [R0603-SHORT]
SPK1  CMI-9650C-120  BUZZER-5MMBUZ-TRANS-5MM-12.4D  [BUZZER-5MM-12.4D]
SW2  SPST  SWITCH_SPSTSWDTS65  [SWITCH_TAC_6MM]
SW3  SPST  SWITCH_SPSTSWDTS65  [SWITCH_TAC_6MM]
SW4  SPST  SWITCH_SPSTSWDTS65  [SWITCH_TAC_6MM]

### Nets
1: IC15.13(B1) J26.3 R114.1
2: IC15.12(B2) J26.2 R113.1
3: IC16.13(B1) J31.1 R122.1
4: IC16.12(B2) J31.3 R121.1
54: IC18.2(A1) ; also sheet 1
55: IC18.3(A2) ; also sheet 1
+3.3V: C62.2 C63.2 C66.2 D14.1(CA) D15.2(A) IC15.1(VREF_A) IC15.8(EN) IC16.1(VREF_A) IC16.8(EN) IC17.1(VCCA) IC18.1(VCCA) IC24.4(VCC1) IC24.12(VDDM) IC24.18(VCC2) J21.3 J30.3 J32.3 J34.3 J40.3 J41.9 J42.2 R107.2 R108.2 R109.2 R110.2 R115.2 R116.2 R117.2 R118.2 R128.2 ; also sheet 1,2,3,5
+5V: C64.2 C65.2 J21.1 J30.1 J32.1 ; also sheet 1,2,5
+VPWR: J22.3 J23.3 ; also sheet 1,2,3
A4/SDA: IC15.3(A2) IC24.24(SDA) R109.1 ; also sheet 1,5
A5/SCL: IC15.2(A1) IC24.25(SCL) R110.1 ; also sheet 1,5
D0/MOSI1: IC16.5(A4) R115.1 ; also sheet 1
D1/MISO1: IC16.2(A1) R118.1 ; also sheet 1
D10/TX2: IC17.2(A1) ; also sheet 1
D12/MISO: IC17.3(A2) ; also sheet 1
D31/A12/RX4/CS1: IC16.4(A3) R116.1 ; also sheet 1
D32/A13/TX4/SCK1: IC16.3(A2) R117.1 ; also sheet 1
D35: Q2.2(A:G) ; also sheet 1
D36: Q2.4(B:G) ; also sheet 1
D37/SCL1: Q3.2(A:G) ; also sheet 1
D38/SDA1: Q3.4(B:G) ; also sheet 1
D39: Q4.2(A:G) ; also sheet 1
D40: Q4.4(B:G) ; also sheet 1
D41: Q5.2(A:G) ; also sheet 1
D42: Q5.4(B:G) ; also sheet 1
D47: IC24.9(NINT) R128.1 ; also sheet 1
GND: C39.1 C40.1 C62.1 C63.1 C64.1 C65.1 C66.1 IC15.7(GND) IC16.7(GND) IC17.4(GND) IC18.4(GND) IC24.3(GND_1) IC24.17(GND_2) IC24.29(GND_(PAD)) J19.1 J20.1 J26.1 J27.1 J31.6 J33.6 J34.1 J40.1 J41.10 J42.8 Q2.1(A:S) Q2.3(B:S) Q3.1(A:S) Q3.3(B:S) Q4.1(A:S) Q4.3(B:S) Q5.1(A:S) Q5.3(B:S) R127.3(START) R163.2 R163.P$2 R164.2 R164.P$2 SPK1.2(-) SW2.1 SW2.2 SW3.1 SW3.2 SW4.1 SW4.2 ; also sheet 1,2,5
N$9: IC15.11(B3) J27.3 R112.1
N$14: IC15.10(B4) J27.2 R111.1
N$15: IC15.14(VREF_B) J21.2 R111.2 R112.2 R113.2 R114.2
N$16: D15.1(K) R123.2
N$17: D14.3(G) R125.2
N$22: IC17.5(DIR) J40.2
N$47: IC17.7(B1) J33.1 R127.1(END)
N$91: J20.2 J23.1
N$92: D7.2(A) J24.3 Q2.5(B:D) Q2.6(B:D)
N$93: J19.2 J22.1
N$94: C39.2 D6.1(K) D7.1(K) D10.1(K) D11.1(K) J22.2 J24.2 J28.2
N$95: D11.2(A) J28.3 Q4.5(B:D) Q4.6(B:D)
N$96: D10.2(A) J28.1 Q4.7(A:D) Q4.8(A:D)
N$97: D6.2(A) J24.1 Q2.7(A:D) Q2.8(A:D)
N$98: C40.2 D8.1(K) D9.1(K) D12.1(K) D13.1(K) J23.2 J25.2 J29.2
N$99: D13.2(A) J29.3 Q5.5(B:D) Q5.6(B:D)
N$100: D12.2(A) J29.1 Q5.7(A:D) Q5.8(A:D)
N$101: D9.2(A) J25.3 Q3.5(B:D) Q3.6(B:D)
N$102: D8.2(A) J25.1 Q3.7(A:D) Q3.8(A:D)
N$126: IC16.10(B4) J31.4 R119.1
N$129: IC16.11(B3) J31.5 R120.1
N$130: IC16.14(VREF_B) J30.2 J31.2 R119.2 R120.2 R121.2 R122.2
N$131: D14.4(R) R124.2
N$132: D14.2(B) R126.2
N$133: IC24.5(I/O[4]) J41.2 R124.1
N$134: IC24.6(I/O[5]) J41.4 R125.1
N$135: IC24.7(I/O[6]) J41.6 R126.1
N$136: IC24.8(I/O[7]) J41.8 R123.1
N$137: IC24.13(I/O[8]) SW2.3 SW2.4
N$138: IC24.14(I/O[9]) SW3.3 SW3.4
N$139: IC24.15(I/O[10]) SW4.3 SW4.4
N$141: IC17.6(B2) J33.2
N$142: R127.2(WIPER) SPK1.1(+)
N$143: IC18.5(DIR) J34.2
N$144: IC18.7(B1) J33.3
N$145: IC18.6(B2) J33.4
N$146: IC24.27(I/O[0]) J41.1
N$147: IC17.8(VCCB) IC18.8(VCCB) J32.2 J33.5
N$161: IC24.28(I/O[1]) J41.3
N$162: IC24.1(I/O[2]) J41.5
N$165: IC24.2(I/O[3]) J41.7
N$186: IC24.19(I/O[12]) J42.1
N$187: IC24.20(I/O[13]) J42.3
N$188: IC24.16(I/O[11]) J42.4
N$189: IC24.21(I/O[14]) J42.5
N$190: IC24.22(I/O[15]) J42.7
N$191: IC24.26(ADDR0) R163.1 R163.P$1
N$192: IC24.10(ADDR1) R164.1 R164.P$1
OSCIO: IC24.11(OSCIO) J42.6
RESET: IC24.23(NRESET) ; also sheet 1,5
SCL3/57: IC15.4(A3) R108.1 ; also sheet 1
SDA3/56: IC15.5(A4) R107.1 ; also sheet 1

### Notes on the sheet
- GPO 1-4
    PWR
- GPO 5-8
    PWR
- I2C-0
- I2C-3
- PWR
  GPO 1-2
- PWR
  GPO 5-6
- PWM | PWM | PWM | PWM
- PWR
  GPO 3-4
- PWR
  GPO 7-8
- SPI-1
  SERIAL-4
- PWM
- GPIO/BUZZER
- GPIO EXPANSION
- SEL | DW | UP

## Sheet 5 of 5
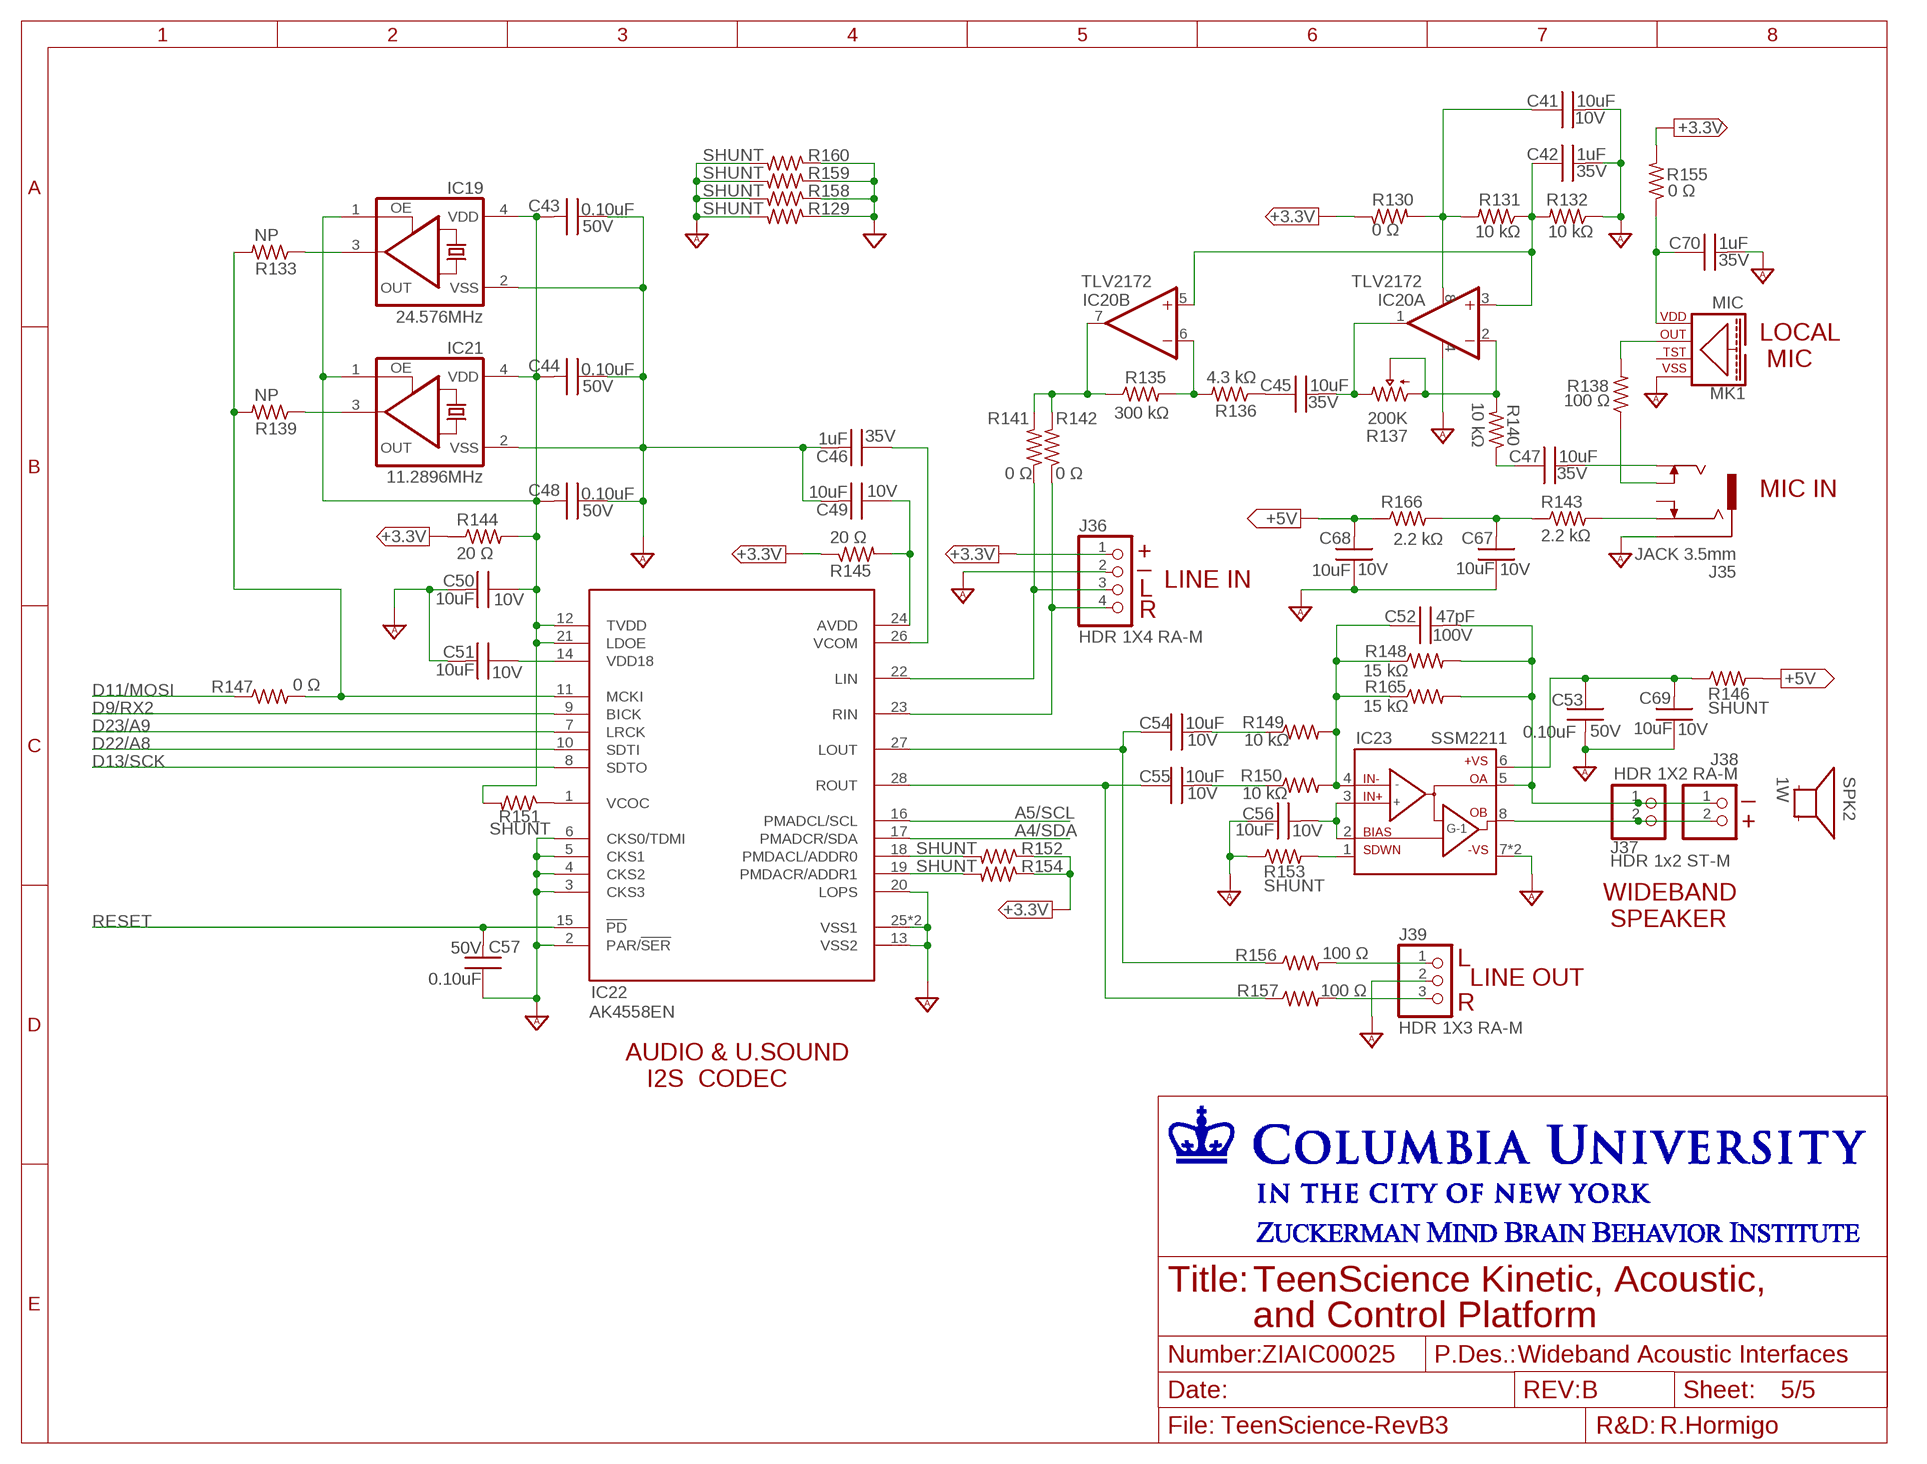
[diagram p4: schematic, sheet 5]
FRAME5 (LETTER_L): ENG_NAME: R.Hormigo; NUMBER: ZIAIC00025; PDESC: Wideband Acoustic Interfaces; REV: B; TITLE_L1: TeenScience Kinetic, Acoustic,; TITLE_L2: and Control Platform

### Parts
C41  10uF  MLCC_0603_10UF-10V  [MLCC_0603]
C42  1uF  MLCC_0603_1UF  [MLCC_0603]
C43  0.10uF  MLCC_0603_100N  [MLCC_0603]
C44  0.10uF  MLCC_0603_100N  [MLCC_0603]
C45  10uF  MLCC1206_  [MLCC_1206]
C46  1uF  MLCC_0603_1UF  [MLCC_0603]
C47  10uF  MLCC1206_  [MLCC_1206]
C48  0.10uF  MLCC_0603_100N  [MLCC_0603]
C49  10uF  MLCC_0603_10UF-10V  [MLCC_0603]
C50  10uF  MLCC_0603_10UF-10V  [MLCC_0603]
C51  10uF  MLCC_0603_10UF-10V  [MLCC_0603]
C52  47pF  MLCC_0603_47P  [MLCC_0603]
C53  0.10uF  MLCC_0603_100N  [MLCC_0603]
C54  10uF  MLCC_0603_10UF-10V  [MLCC_0603]
C55  10uF  MLCC_0603_10UF-10V  [MLCC_0603]
C56  10uF  MLCC_0603_10UF-10V  [MLCC_0603]
C57  0.10uF  MLCC_0603_100N  [MLCC_0603]
C67  10uF  MLCC_0603_10UF-10V  [MLCC_0603]
C68  10uF  MLCC_0603_10UF-10V  [MLCC_0603]
C69  10uF  MLCC_0603_10UF-10V  [MLCC_0603]
C70  1uF  MLCC_0603_1UF  [MLCC_0603]
IC19  24.576MHz  OSC_OEOSC24_576_50  [2.5X2-4-PAD]
IC20  TLV2172  OPA_D_TLV2172IDGKR  [VSSOP8-DGK-065P]
IC21  11.2896MHz  OSC_OEOSC11_2896_50  [2.5X2-4-PAD]
IC22  AK4558EN  AK4558ENAK4558EN  [QFN-28-5MM-0.5P-PAD]
IC23  SSM2211  SSM2211SSM2211  [LFCSP8_3X3]
J35  JACK 3.5mm  AUDIOJACK  [AUDIO-JACK-SJ1-3533NS]
J36  HDR 1X4 RA-M  PIN-1X4HDR_1X4RAS_M  [HDR_1X4RAS]
J37  HDR 1x2 ST-M  PIN-1X22STMSHDR  [HDR_1X2]
J38  HDR 1X2 RA-M  PIN-1X2HDR_1X2RAS_M  [HDR_1X2RAS]
J39  HDR 1X3 RA-M  PIN-1X3HDR_1X3RAS_M  [HDR_1X3RAS]
MK1  MIC  MEMS-MICROPHONE-AMEMSSPH6611  [SPH6611_MEMS_2.65X3.50]
R129  SHUNT  RES_0603_SHUNT  [R0603-SHORT]
R130  0 Ω  RES_0603_0000  [R0603]
R131  10 kΩ  RES_0603_10K0  [R0603]
R132  10 kΩ  RES_0603_10K0  [R0603]
R133  NP  RES_0603_NP  [R0603]
R135  300 kΩ  RES_0603_300K  [R0603]
R136  4.3 kΩ  RES_0603_4K30  [R0603]
R137  200K  RES_TRIM_RES_200K_SMT_TRIM_4.5MM_10K  [SM-4.5X4.5-TRIM]
R138  100 Ω  RES_0603_100R  [R0603]
R139  NP  RES_0603_NP  [R0603]
R140  10 kΩ  RES_0603_10K0  [R0603]
R141  0 Ω  RES_0603_0000  [R0603]
R142  0 Ω  RES_0603_0000  [R0603]
R143  2.2 kΩ  RES_0603_2K20  [R0603]
R144  20 Ω  RES_0603_20R0  [R0603]
R145  20 Ω  RES_0603_20R0  [R0603]
R146  SHUNT  RES_0603_SHUNT  [R0603-SHORT]
R147  0 Ω  RES_0603_0000  [R0603]
R148  15 kΩ  RES_0603_15K0  [R0603]
R149  10 kΩ  RES_0603_10K0  [R0603]
R150  10 kΩ  RES_0603_10K0  [R0603]
R151  SHUNT  RES_0603_SHUNT  [R0603-SHORT]
R152  SHUNT  RES_0603_SHUNT  [R0603-SHORT]
R153  SHUNT  RES_0603_SHUNT  [R0603-SHORT]
R154  SHUNT  RES_0603_SHUNT  [R0603-SHORT]
R155  0 Ω  RES_0603_0000  [R0603]
R156  100 Ω  RES_0603_100R  [R0603]
R157  100 Ω  RES_0603_100R  [R0603]
R158  SHUNT  RES_0603_SHUNT  [R0603-SHORT]
R159  SHUNT  RES_0603_SHUNT  [R0603-SHORT]
R160  SHUNT  RES_0603_SHUNT  [R0603-SHORT]
R165  15 kΩ  RES_0603_15K0  [R0603]
R166  2.2 kΩ  RES_0603_2K20  [R0603]
SPK2  1W  SPEAKERSPK1W  [EXTERNAL]

### Nets
+3.3V: J36.1 R130.1 R144.1 R145.1 R152.1 R152.P$1 R154.1 R154.P$1 R155.2 ; also sheet 1,2,3,4
+5V: C68.2 R146.2 R146.P$2 R166.1 ; also sheet 1,2,4
A4/SDA: IC22.17(PMADCR/SDA) ; also sheet 1,4
A5/SCL: IC22.16(PMADCL/SCL) ; also sheet 1,4
D9/RX2: IC22.9(BICK) ; also sheet 1
D11/MOSI: R147.1 ; also sheet 1
D13/SCK: IC22.8(SDTO) ; also sheet 1
D22/A8: IC22.10(SDTI) ; also sheet 1
D23/A9: IC22.7(LRCK) ; also sheet 1
GND: R129.1 R129.P$1 R158.1 R158.P$1 R159.1 R159.P$1 R160.1 R160.P$1 ; also sheet 1,2,4
GND_A: C41.2 C42.2 C43.1 C44.1 C46.2 C48.1 C49.2 C50.2 C51.2 C53.2 C56.1 C57.1 C67.1 C68.1 C69.1 C70.2 IC19.2(VSS) IC20.4(A:V-) IC21.2(VSS) IC22.2(PAR/!SER) IC22.3(CKS3) IC22.4(CKS2) IC22.5(CKS1) IC22.6(CKS0/TDMI) IC22.13(VSS2) IC22.20(LOPS) IC22.25(VSS1) IC22.29(VSS1) IC23.7(-VS) IC23.EXP(-VS) J35.1(SLEEVE) J36.2 J39.2 MK1.2(VSS) MK1.3(VSS) R129.2 R129.P$2 R132.1 R153.1 R153.P$1 R158.2 R158.P$2 R159.2 R159.P$2 R160.2 R160.P$2 ; also sheet 1,3
N$19: IC23.8(OUTB) J37.2 J38.2
N$140: C46.1 IC22.26(VCOM)
N$148: C49.1 IC22.24(AVDD) R145.2
N$149: C43.2 C44.2 C48.2 C50.1 IC19.1(CON) IC19.4(VDD) IC21.1(CON) IC21.4(VDD) IC22.12(TVDD) IC22.21(LDOE) R144.2 R151.2 R151.P$2
N$150: C51.1 IC22.14(VDD18)
N$151: IC22.1(VCOC) R151.1 R151.P$1
N$152: C70.1 MK1.5(VDD) R155.1
N$153: IC23.1(SDWN) R153.2 R153.P$2
N$154: C56.2 IC23.2(BIAS) IC23.3(IN+)
N$155: C52.2 IC23.5(OUTA) J37.1 J38.1 R148.2 R165.2
N$156: C52.1 IC23.4(IN-) R148.1 R149.2 R150.2 R165.1
N$157: IC22.11(MCKI) R133.2 R139.2 R147.2
N$158: IC22.18(PMDACL/ADDR0) R152.2 R152.P$2
N$159: IC22.19(PMDACR/ADDR1) R154.2 R154.P$2
N$160: C55.2 R150.1
N$163: IC21.3(OUT) R139.1
N$164: IC19.3(OUT) R133.1
N$166: C54.2 R149.1
N$167: C55.1 IC22.28(ROUT) R157.1
N$168: C54.1 IC22.27(LOUT) R156.1
N$169: C53.1 C69.2 IC23.6(+VS) R146.1 R146.P$1
N$170: J39.3 R157.2
N$171: J39.1 R156.2
N$172: C47.1 R140.1
N$173: IC22.23(RIN) J36.4 R142.1
N$174: IC22.22(LIN) J36.3 R141.1
N$175: C47.2 J35.2(TIP)
N$176: IC20.2(A:-IN) R137.2(WIPER) R137.3(START) R140.2
N$177: C45.1 R136.1
N$178: C45.2 IC20.1(A:OUT) R137.1(END)
N$179: IC20.6(B:-IN) R135.2 R136.2
N$180: IC20.7(B:OUT) R135.1 R141.2 R142.2
N$181: C41.1 IC20.8(A:V+) R130.2 R131.2
N$182: C42.1 IC20.3(A:+IN) IC20.5(B:+IN) R131.1 R132.2
N$183: J35.4(SW_TIP) R138.1
N$184: J35.3(RING) R143.2
N$185: MK1.1(OUT) R138.2
N$193: C67.2 R143.1 R166.2
RESET: C57.2 IC22.15(!PD) ; also sheet 1,4
Unconnected: J35.5(SW_RING) MK1.4(TST)

### Notes on the sheet
- LOCAL
   MIC
- MIC IN
- +
- _
- LINE IN
- L
- R
- _
- +
- WIDEBAND
   SPEAKER
- L
- LINE OUT
- R
- AUDIO & U.SOUND
     I2S  CODEC

## Power pins joined to a net without a drawn wire
VUSB1: M1.VUSB1